# EasyEDA Pro project kuafu02_NI高低温板.eprj, board PCB1
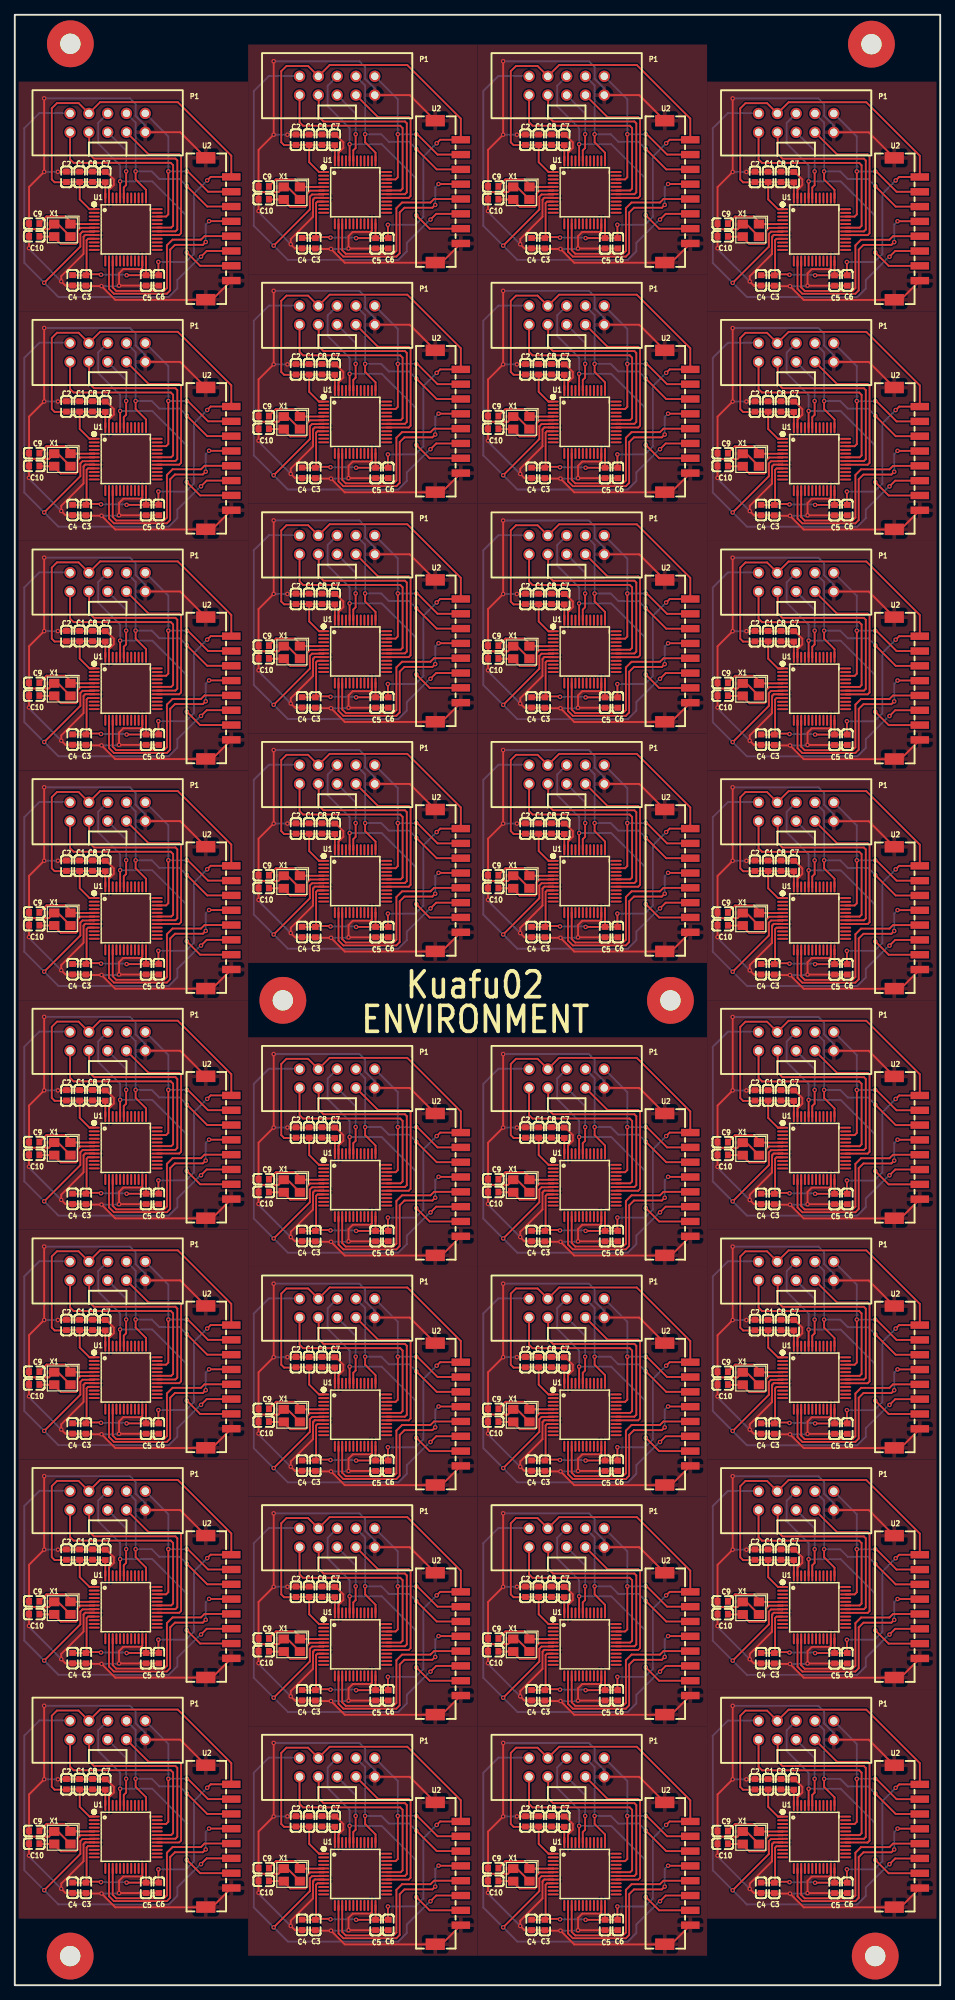
[diagram p1: board, top side]
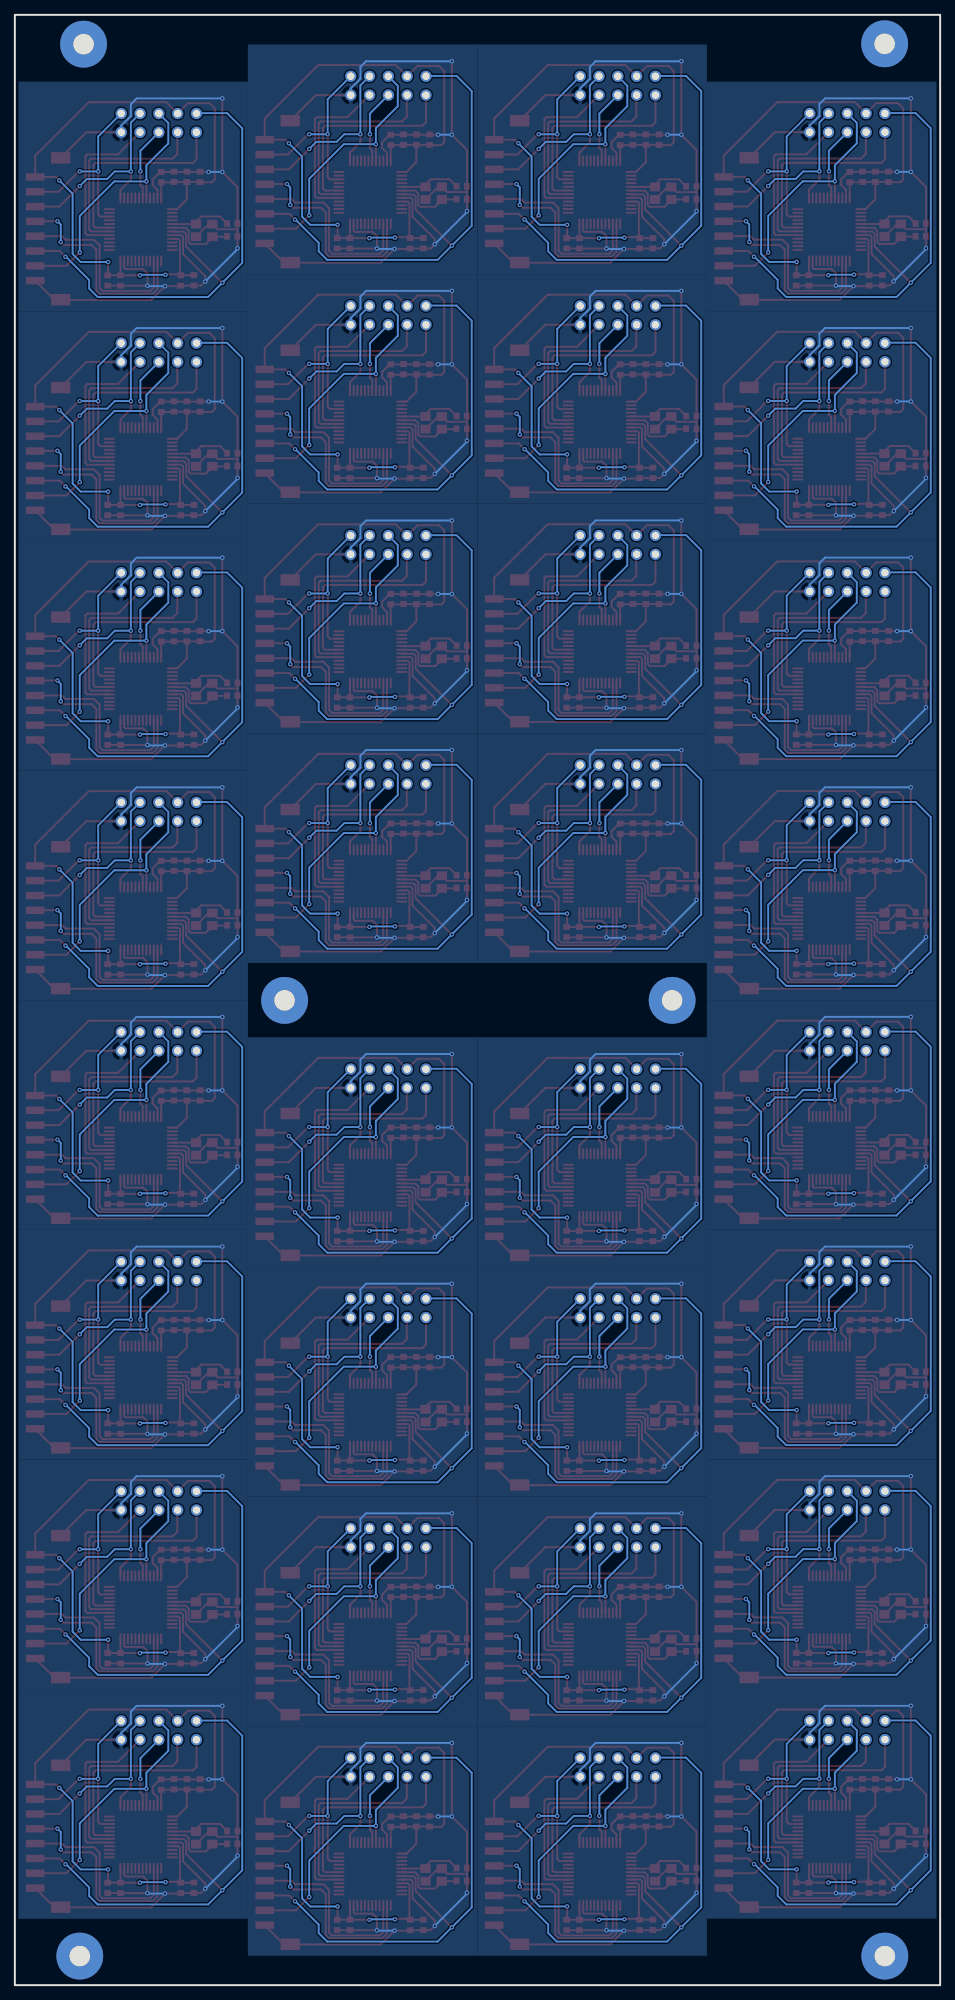
[diagram p2: board, bottom side, seen from below]

Outline 125 x 266 mm; copper layers: Top Layer, Bottom Layer. Coordinates in mm from the lower left corner of the outline.
Outline path: rectangle 0,266 125,0
Stack: Top Layer 0.035mm / Dielectric1 1.51mm FR4 er 4.5 / Bottom Layer 0.035mm

## Design rules (mm)
template: 自定义配置
spacing copperThickness1oz (default): track to track 0.102, other pairs 0.152 to 0.3
spacing copperThickness2oz: track to track 0.203, other pairs 0.152 to 0.3
track width copperThickness1oz (default): min 0.127, default 0.254, max 2.54
track width copperThickness2oz: min 0.203, default 0.254, max 2.54
differential pair differentialPair (default): width min 0.127, default 0.254, max 2.54; gap min 0.152, default 0.152
via viaSize (default): diameter min 0.5, default 0.61, max 10; hole min 0.3, default 0.305, max 6.3

## Placement (name value [footprint] x y rotation side)
C1  100nF  [C0603]  8.75 244.13 90 top
C1#2  -  [C0603]  8.75 213.13 90 top
C1#3  -  [C0603]  8.75 182.13 90 top
C1#4  -  [C0603]  8.75 151.13 90 top
C1#5  -  [C0603]  8.75 120.13 90 top
C1#6  -  [C0603]  8.75 89.13 90 top
C1#7  -  [C0603]  8.75 58.13 90 top
C1#8  -  [C0603]  8.75 27.13 90 top
C1#9  -  [C0603]  39.75 249.14 90 top
C1#10  -  [C0603]  39.75 218.14 90 top
C1#11  -  [C0603]  39.75 187.15 90 top
C1#12  -  [C0603]  39.75 156.15 90 top
C1#13  -  [C0603]  39.75 115.11 90 top
C1#14  -  [C0603]  39.75 84.11 90 top
C1#15  -  [C0603]  39.75 53.11 90 top
C1#16  -  [C0603]  39.75 22.11 90 top
C1#17  -  [C0603]  70.75 249.14 90 top
C1#18  -  [C0603]  70.75 218.14 90 top
C1#19  -  [C0603]  70.75 187.14 90 top
C1#20  -  [C0603]  70.75 156.15 90 top
C1#21  -  [C0603]  70.75 115.11 90 top
C1#22  -  [C0603]  70.75 84.11 90 top
C1#23  -  [C0603]  70.75 53.11 90 top
C1#24  -  [C0603]  70.75 22.11 90 top
C1#25  -  [C0603]  101.75 244.12 90 top
C1#26  -  [C0603]  101.75 213.12 90 top
C1#27  -  [C0603]  101.75 182.12 90 top
C1#28  -  [C0603]  101.75 151.12 90 top
C1#29  -  [C0603]  101.75 120.12 90 top
C1#30  -  [C0603]  101.75 89.12 90 top
C1#31  -  [C0603]  101.75 58.12 90 top
C1#32  -  [C0603]  101.75 27.12 90 top
C2  10uF  [C0603]  6.97 27.13 90 top
C2#2  -  [C0603]  99.98 89.12 90 top
C2#3  -  [C0603]  6.97 213.13 90 top
C2#4  -  [C0603]  6.97 182.13 90 top
C2#5  -  [C0603]  6.97 151.13 90 top
C2#6  -  [C0603]  6.97 120.13 90 top
C2#7  -  [C0603]  6.97 89.13 90 top
C2#8  -  [C0603]  6.97 58.13 90 top
C2#9  -  [C0603]  37.97 249.14 90 top
C2#10  -  [C0603]  37.97 218.14 90 top
C2#11  -  [C0603]  37.97 187.15 90 top
C2#12  -  [C0603]  37.97 156.15 90 top
C2#13  -  [C0603]  37.97 115.11 90 top
C2#14  -  [C0603]  37.97 84.11 90 top
C2#15  -  [C0603]  37.97 53.11 90 top
C2#16  -  [C0603]  37.97 22.11 90 top
C2#17  -  [C0603]  68.98 249.14 90 top
C2#18  -  [C0603]  68.98 218.14 90 top
C2#19  -  [C0603]  68.98 187.14 90 top
C2#20  -  [C0603]  68.98 156.15 90 top
C2#21  -  [C0603]  68.98 115.11 90 top
C2#22  -  [C0603]  68.98 84.11 90 top
C2#23  -  [C0603]  68.98 53.11 90 top
C2#24  -  [C0603]  68.98 22.11 90 top
C2#25  -  [C0603]  99.98 244.12 90 top
C2#26  -  [C0603]  6.97 244.13 90 top
C2#27  -  [C0603]  99.98 213.12 90 top
C2#28  -  [C0603]  99.98 182.12 90 top
C2#29  -  [C0603]  99.98 151.12 90 top
C2#30  -  [C0603]  99.98 120.12 90 top
C2#31  -  [C0603]  99.98 58.12 90 top
C2#32  -  [C0603]  99.98 27.12 90 top
C3  100nF  [C0603]  9.6 199.14 90 top
C3#2  -  [C0603]  9.6 168.14 90 top
C3#3  -  [C0603]  9.6 137.14 90 top
C3#4  -  [C0603]  9.6 106.14 90 top
C3#5  -  [C0603]  9.6 75.14 90 top
C3#6  -  [C0603]  9.6 44.14 90 top
C3#7  -  [C0603]  9.6 13.14 90 top
C3#8  -  [C0603]  40.6 235.16 90 top
C3#9  -  [C0603]  40.6 204.16 90 top
C3#10  -  [C0603]  40.6 173.16 90 top
C3#11  -  [C0603]  40.6 142.16 90 top
C3#12  -  [C0603]  40.6 101.13 90 top
C3#13  -  [C0603]  40.6 70.13 90 top
C3#14  -  [C0603]  40.6 39.13 90 top
C3#15  -  [C0603]  40.6 8.13 90 top
C3#16  -  [C0603]  71.6 235.16 90 top
C3#17  -  [C0603]  71.6 204.16 90 top
C3#18  -  [C0603]  71.6 173.16 90 top
C3#19  -  [C0603]  71.6 142.16 90 top
C3#20  -  [C0603]  71.6 101.13 90 top
C3#21  -  [C0603]  71.6 70.13 90 top
C3#22  -  [C0603]  71.6 39.13 90 top
C3#23  -  [C0603]  71.6 8.13 90 top
C3#24  -  [C0603]  102.6 230.13 90 top
C3#25  -  [C0603]  102.6 199.13 90 top
C3#26  -  [C0603]  102.6 168.13 90 top
C3#27  -  [C0603]  102.6 137.13 90 top
C3#28  -  [C0603]  102.6 106.13 90 top
C3#29  -  [C0603]  102.6 75.13 90 top
C3#30  -  [C0603]  102.6 44.13 90 top
C3#31  -  [C0603]  9.6 230.14 90 top
C3#32  -  [C0603]  102.6 13.13 90 top
C4  10uF  [C0603]  7.8 13.16 90 top
C4#2  -  [C0603]  100.8 75.15 90 top
C4#3  -  [C0603]  7.8 199.16 90 top
C4#4  -  [C0603]  7.8 168.16 90 top
C4#5  -  [C0603]  7.8 137.16 90 top
C4#6  -  [C0603]  7.8 106.16 90 top
C4#7  -  [C0603]  7.8 75.16 90 top
C4#8  -  [C0603]  7.8 44.16 90 top
C4#9  -  [C0603]  38.8 235.17 90 top
C4#10  -  [C0603]  38.8 204.17 90 top
C4#11  -  [C0603]  38.8 173.18 90 top
C4#12  -  [C0603]  38.8 142.18 90 top
C4#13  -  [C0603]  38.8 101.14 90 top
C4#14  -  [C0603]  38.8 70.14 90 top
C4#15  -  [C0603]  38.8 39.14 90 top
C4#16  -  [C0603]  38.8 8.14 90 top
C4#17  -  [C0603]  69.8 235.17 90 top
C4#18  -  [C0603]  69.8 204.17 90 top
C4#19  -  [C0603]  69.8 173.17 90 top
C4#20  -  [C0603]  69.8 142.18 90 top
C4#21  -  [C0603]  69.8 101.14 90 top
C4#22  -  [C0603]  69.8 70.14 90 top
C4#23  -  [C0603]  69.8 39.14 90 top
C4#24  -  [C0603]  69.8 8.14 90 top
C4#25  -  [C0603]  100.8 230.15 90 top
C4#26  -  [C0603]  100.8 199.15 90 top
C4#27  -  [C0603]  100.8 168.15 90 top
C4#28  -  [C0603]  100.8 137.15 90 top
C4#29  -  [C0603]  100.8 106.15 90 top
C4#30  -  [C0603]  100.8 44.15 90 top
C4#31  -  [C0603]  100.8 13.15 90 top
C4#32  -  [C0603]  7.8 230.16 90 top
C5  100nF  [C0603]  17.73 199.14 90 top
C5#2  -  [C0603]  17.73 168.14 90 top
C5#3  -  [C0603]  17.73 137.14 90 top
C5#4  -  [C0603]  17.73 106.14 90 top
C5#5  -  [C0603]  17.73 75.14 90 top
C5#6  -  [C0603]  17.73 44.14 90 top
C5#7  -  [C0603]  17.73 13.14 90 top
C5#8  -  [C0603]  48.73 235.16 90 top
C5#9  -  [C0603]  48.73 204.16 90 top
C5#10  -  [C0603]  48.73 173.16 90 top
C5#11  -  [C0603]  48.73 142.16 90 top
C5#12  -  [C0603]  48.73 101.13 90 top
C5#13  -  [C0603]  48.73 70.13 90 top
C5#14  -  [C0603]  48.73 39.13 90 top
C5#15  -  [C0603]  48.73 8.13 90 top
C5#16  -  [C0603]  79.73 235.16 90 top
C5#17  -  [C0603]  79.73 204.16 90 top
C5#18  -  [C0603]  79.73 173.16 90 top
C5#19  -  [C0603]  79.73 142.16 90 top
C5#20  -  [C0603]  79.73 101.13 90 top
C5#21  -  [C0603]  79.73 70.13 90 top
C5#22  -  [C0603]  79.73 39.13 90 top
C5#23  -  [C0603]  79.73 8.13 90 top
C5#24  -  [C0603]  110.73 230.13 90 top
C5#25  -  [C0603]  110.73 199.13 90 top
C5#26  -  [C0603]  110.73 168.13 90 top
C5#27  -  [C0603]  110.73 137.13 90 top
C5#28  -  [C0603]  110.73 106.13 90 top
C5#29  -  [C0603]  110.73 75.13 90 top
C5#30  -  [C0603]  110.73 44.13 90 top
C5#31  -  [C0603]  110.73 13.13 90 top
C5#32  -  [C0603]  17.73 230.14 90 top
C6  10uF  [C0603]  19.46 199.14 270 top
C6#2  -  [C0603]  19.46 168.14 270 top
C6#3  -  [C0603]  19.46 137.14 270 top
C6#4  -  [C0603]  19.46 106.14 270 top
C6#5  -  [C0603]  19.46 75.14 270 top
C6#6  -  [C0603]  19.46 44.14 270 top
C6#7  -  [C0603]  19.46 13.14 270 top
C6#8  -  [C0603]  50.46 235.16 270 top
C6#9  -  [C0603]  50.46 204.16 270 top
C6#10  -  [C0603]  50.46 173.16 270 top
C6#11  -  [C0603]  50.46 142.16 270 top
C6#12  -  [C0603]  50.46 101.13 270 top
C6#13  -  [C0603]  50.46 70.13 270 top
C6#14  -  [C0603]  50.46 39.13 270 top
C6#15  -  [C0603]  50.46 8.13 270 top
C6#16  -  [C0603]  81.46 235.16 270 top
C6#17  -  [C0603]  81.46 204.16 270 top
C6#18  -  [C0603]  81.46 173.16 270 top
C6#19  -  [C0603]  81.46 142.16 270 top
C6#20  -  [C0603]  81.46 101.13 270 top
C6#21  -  [C0603]  81.46 70.13 270 top
C6#22  -  [C0603]  81.46 39.13 270 top
C6#23  -  [C0603]  81.46 8.13 270 top
C6#24  -  [C0603]  112.46 230.13 270 top
C6#25  -  [C0603]  112.46 199.13 270 top
C6#26  -  [C0603]  112.46 168.13 270 top
C6#27  -  [C0603]  112.46 137.13 270 top
C6#28  -  [C0603]  112.46 106.13 270 top
C6#29  -  [C0603]  112.46 75.13 270 top
C6#30  -  [C0603]  112.46 44.13 270 top
C6#31  -  [C0603]  112.46 13.13 270 top
C6#32  -  [C0603]  19.46 230.14 270 top
C7  100nF  [C0603]  12.22 213.1 270 top
C7#2  -  [C0603]  12.22 182.1 270 top
C7#3  -  [C0603]  12.22 151.1 270 top
C7#4  -  [C0603]  12.22 120.1 270 top
C7#5  -  [C0603]  12.22 89.1 270 top
C7#6  -  [C0603]  12.22 58.1 270 top
C7#7  -  [C0603]  12.22 27.1 270 top
C7#8  -  [C0603]  43.22 249.11 270 top
C7#9  -  [C0603]  43.22 218.11 270 top
C7#10  -  [C0603]  74.22 187.11 270 top
C7#11  -  [C0603]  43.22 187.12 270 top
C7#12  -  [C0603]  43.22 156.12 270 top
C7#13  -  [C0603]  12.22 244.1 270 top
C7#14  -  [C0603]  43.22 115.08 270 top
C7#15  -  [C0603]  43.22 84.08 270 top
C7#16  -  [C0603]  43.22 53.08 270 top
C7#17  -  [C0603]  43.22 22.08 270 top
C7#18  -  [C0603]  74.22 249.11 270 top
C7#19  -  [C0603]  74.22 218.11 270 top
C7#20  -  [C0603]  74.22 156.12 270 top
C7#21  -  [C0603]  74.22 115.08 270 top
C7#22  -  [C0603]  74.22 84.08 270 top
C7#23  -  [C0603]  74.22 53.08 270 top
C7#24  -  [C0603]  74.22 22.08 270 top
C7#25  -  [C0603]  105.22 244.09 270 top
C7#26  -  [C0603]  105.22 213.09 270 top
C7#27  -  [C0603]  105.22 182.09 270 top
C7#28  -  [C0603]  105.22 151.09 270 top
C7#29  -  [C0603]  105.22 120.09 270 top
C7#30  -  [C0603]  105.22 89.09 270 top
C7#31  -  [C0603]  105.22 58.09 270 top
C7#32  -  [C0603]  105.22 27.09 270 top
C8  10uF  [C0603]  10.5 213.14 90 top
C8#2  -  [C0603]  10.5 182.14 90 top
C8#3  -  [C0603]  10.5 151.14 90 top
C8#4  -  [C0603]  10.5 120.14 90 top
C8#5  -  [C0603]  10.5 89.14 90 top
C8#6  -  [C0603]  10.5 58.14 90 top
C8#7  -  [C0603]  10.5 27.14 90 top
C8#8  -  [C0603]  41.5 249.15 90 top
C8#9  -  [C0603]  41.5 218.15 90 top
C8#10  -  [C0603]  41.5 187.16 90 top
C8#11  -  [C0603]  41.5 156.16 90 top
C8#12  -  [C0603]  10.5 244.14 90 top
C8#13  -  [C0603]  41.5 115.12 90 top
C8#14  -  [C0603]  41.5 84.12 90 top
C8#15  -  [C0603]  41.5 53.12 90 top
C8#16  -  [C0603]  41.5 22.12 90 top
C8#17  -  [C0603]  72.5 249.15 90 top
C8#18  -  [C0603]  72.5 218.15 90 top
C8#19  -  [C0603]  72.5 187.15 90 top
C8#20  -  [C0603]  72.5 156.16 90 top
C8#21  -  [C0603]  72.5 115.12 90 top
C8#22  -  [C0603]  72.5 84.12 90 top
C8#23  -  [C0603]  72.5 53.12 90 top
C8#24  -  [C0603]  72.5 22.12 90 top
C8#25  -  [C0603]  103.5 244.13 90 top
C8#26  -  [C0603]  103.5 213.13 90 top
C8#27  -  [C0603]  103.5 182.13 90 top
C8#28  -  [C0603]  103.5 151.13 90 top
C8#29  -  [C0603]  103.5 120.13 90 top
C8#30  -  [C0603]  103.5 89.13 90 top
C8#31  -  [C0603]  103.5 58.13 90 top
C8#32  -  [C0603]  103.5 27.13 90 top
C9  12pF  [C0603]  2.62 206.82 180 top
C9#2  -  [C0603]  2.62 175.82 180 top
C9#3  -  [C0603]  2.62 144.82 180 top
C9#4  -  [C0603]  2.62 113.82 180 top
C9#5  -  [C0603]  2.62 82.82 180 top
C9#6  -  [C0603]  2.62 51.82 180 top
C9#7  -  [C0603]  2.62 20.82 180 top
C9#8  -  [C0603]  33.62 242.84 180 top
C9#9  -  [C0603]  33.62 211.84 180 top
C9#10  -  [C0603]  33.62 180.84 180 top
C9#11  -  [C0603]  33.62 149.84 180 top
C9#12  -  [C0603]  33.62 108.81 180 top
C9#13  -  [C0603]  33.62 77.81 180 top
C9#14  -  [C0603]  33.62 46.81 180 top
C9#15  -  [C0603]  2.62 237.82 180 top
C9#16  -  [C0603]  33.62 15.81 180 top
C9#17  -  [C0603]  64.62 242.84 180 top
C9#18  -  [C0603]  64.62 211.84 180 top
C9#19  -  [C0603]  64.62 180.84 180 top
C9#20  -  [C0603]  64.62 149.84 180 top
C9#21  -  [C0603]  64.62 108.81 180 top
C9#22  -  [C0603]  64.62 77.81 180 top
C9#23  -  [C0603]  64.62 46.81 180 top
C9#24  -  [C0603]  64.62 15.81 180 top
C9#25  -  [C0603]  95.62 237.81 180 top
C9#26  -  [C0603]  95.62 206.81 180 top
C9#27  -  [C0603]  95.62 175.81 180 top
C9#28  -  [C0603]  95.62 144.81 180 top
C9#29  -  [C0603]  95.62 113.81 180 top
C9#30  -  [C0603]  95.62 82.81 180 top
C9#31  -  [C0603]  95.62 51.81 180 top
C9#32  -  [C0603]  95.62 20.81 180 top
C10  12pF  [C0603]  2.62 205.1 0 top
C10#2  -  [C0603]  2.62 174.1 0 top
C10#3  -  [C0603]  2.62 143.1 0 top
C10#4  -  [C0603]  2.62 112.1 0 top
C10#5  -  [C0603]  2.62 81.1 0 top
C10#6  -  [C0603]  2.62 50.1 0 top
C10#7  -  [C0603]  2.62 19.1 0 top
C10#8  -  [C0603]  33.62 241.11 0 top
C10#9  -  [C0603]  33.62 210.11 0 top
C10#10  -  [C0603]  33.62 179.12 0 top
C10#11  -  [C0603]  33.62 148.12 0 top
C10#12  -  [C0603]  33.62 107.08 0 top
C10#13  -  [C0603]  33.62 76.08 0 top
C10#14  -  [C0603]  33.62 45.08 0 top
C10#15  -  [C0603]  33.62 14.08 0 top
C10#16  -  [C0603]  2.62 236.1 0 top
C10#17  -  [C0603]  64.62 241.11 0 top
C10#18  -  [C0603]  64.62 210.11 0 top
C10#19  -  [C0603]  64.62 179.11 0 top
C10#20  -  [C0603]  64.62 148.12 0 top
C10#21  -  [C0603]  64.62 107.08 0 top
C10#22  -  [C0603]  64.62 76.08 0 top
C10#23  -  [C0603]  64.62 45.08 0 top
C10#24  -  [C0603]  64.62 14.08 0 top
C10#25  -  [C0603]  95.62 236.09 0 top
C10#26  -  [C0603]  95.62 205.09 0 top
C10#27  -  [C0603]  95.62 174.09 0 top
C10#28  -  [C0603]  95.62 143.09 0 top
C10#29  -  [C0603]  95.62 112.09 0 top
C10#30  -  [C0603]  95.62 81.09 0 top
C10#31  -  [C0603]  95.62 50.09 0 top
C10#32  -  [C0603]  95.62 19.09 0 top
J1  -  [demo板安装孔]  7.48 3.93 0 top
J1#2  -  [demo板安装孔]  36.21 132.95 0 top
J1#3  -  [demo板安装孔]  115.71 262.03 0 top
J1#4  -  [demo板安装孔]  88.56 132.95 0 top
J1#5  -  [demo板安装孔]  116.22 3.93 0 top
J1#6  -  [demo板安装孔]  7.5 262.09 0 top
P1  2.54-2*5P简牛  [IDC-TH_10P-P2.54_C5665]  12.54 220.42 0 top
P1#2  -  [IDC-TH_10P-P2.54_C5665]  12.54 189.42 0 top
P1#3  -  [IDC-TH_10P-P2.54_C5665]  12.54 158.42 0 top
P1#4  -  [IDC-TH_10P-P2.54_C5665]  12.54 127.42 0 top
P1#5  -  [IDC-TH_10P-P2.54_C5665]  12.54 96.42 0 top
P1#6  -  [IDC-TH_10P-P2.54_C5665]  12.54 65.42 0 top
P1#7  -  [IDC-TH_10P-P2.54_C5665]  12.54 34.42 0 top
P1#8  -  [IDC-TH_10P-P2.54_C5665]  43.54 256.43 0 top
P1#9  -  [IDC-TH_10P-P2.54_C5665]  43.54 225.43 0 top
P1#10  -  [IDC-TH_10P-P2.54_C5665]  43.54 194.44 0 top
P1#11  -  [IDC-TH_10P-P2.54_C5665]  43.54 163.44 0 top
P1#12  -  [IDC-TH_10P-P2.54_C5665]  43.54 122.4 0 top
P1#13  -  [IDC-TH_10P-P2.54_C5665]  43.54 91.4 0 top
P1#14  -  [IDC-TH_10P-P2.54_C5665]  12.54 251.42 0 top
P1#15  -  [IDC-TH_10P-P2.54_C5665]  43.54 60.4 0 top
P1#16  -  [IDC-TH_10P-P2.54_C5665]  43.54 29.4 0 top
P1#17  -  [IDC-TH_10P-P2.54_C5665]  74.54 256.43 0 top
P1#18  -  [IDC-TH_10P-P2.54_C5665]  74.54 225.43 0 top
P1#19  -  [IDC-TH_10P-P2.54_C5665]  74.54 194.43 0 top
P1#20  -  [IDC-TH_10P-P2.54_C5665]  74.54 163.44 0 top
P1#21  -  [IDC-TH_10P-P2.54_C5665]  74.54 122.4 0 top
P1#22  -  [IDC-TH_10P-P2.54_C5665]  74.54 91.4 0 top
P1#23  -  [IDC-TH_10P-P2.54_C5665]  74.54 60.4 0 top
P1#24  -  [IDC-TH_10P-P2.54_C5665]  74.54 29.4 0 top
P1#25  -  [IDC-TH_10P-P2.54_C5665]  105.54 251.41 0 top
P1#26  -  [IDC-TH_10P-P2.54_C5665]  105.54 220.41 0 top
P1#27  -  [IDC-TH_10P-P2.54_C5665]  105.54 189.41 0 top
P1#28  -  [IDC-TH_10P-P2.54_C5665]  105.54 158.41 0 top
P1#29  -  [IDC-TH_10P-P2.54_C5665]  105.54 127.41 0 top
P1#30  -  [IDC-TH_10P-P2.54_C5665]  105.54 96.41 0 top
P1#31  -  [IDC-TH_10P-P2.54_C5665]  105.54 65.41 0 top
P1#32  -  [IDC-TH_10P-P2.54_C5665]  105.54 34.41 0 top
U1  -  [LQFP-48_L7.0-W7.0-P0.50-LS9.0-BL]  14.98 206.02 270 top
U1#2  -  [LQFP-48_L7.0-W7.0-P0.50-LS9.0-BL]  14.98 175.02 270 top
U1#3  -  [LQFP-48_L7.0-W7.0-P0.50-LS9.0-BL]  14.98 144.02 270 top
U1#4  -  [LQFP-48_L7.0-W7.0-P0.50-LS9.0-BL]  14.98 113.02 270 top
U1#5  -  [LQFP-48_L7.0-W7.0-P0.50-LS9.0-BL]  14.98 82.02 270 top
U1#6  -  [LQFP-48_L7.0-W7.0-P0.50-LS9.0-BL]  14.98 51.02 270 top
U1#7  -  [LQFP-48_L7.0-W7.0-P0.50-LS9.0-BL]  14.98 20.02 270 top
U1#8  -  [LQFP-48_L7.0-W7.0-P0.50-LS9.0-BL]  45.98 242.03 270 top
U1#9  -  [LQFP-48_L7.0-W7.0-P0.50-LS9.0-BL]  45.98 211.03 270 top
U1#10  -  [LQFP-48_L7.0-W7.0-P0.50-LS9.0-BL]  45.98 180.04 270 top
U1#11  -  [LQFP-48_L7.0-W7.0-P0.50-LS9.0-BL]  45.98 149.04 270 top
U1#12  -  [LQFP-48_L7.0-W7.0-P0.50-LS9.0-BL]  45.98 108 270 top
U1#13  -  [LQFP-48_L7.0-W7.0-P0.50-LS9.0-BL]  45.98 77 270 top
U1#14  -  [LQFP-48_L7.0-W7.0-P0.50-LS9.0-BL]  45.98 46 270 top
U1#15  -  [LQFP-48_L7.0-W7.0-P0.50-LS9.0-BL]  45.98 15 270 top
U1#16  -  [LQFP-48_L7.0-W7.0-P0.50-LS9.0-BL]  76.98 242.03 270 top
U1#17  -  [LQFP-48_L7.0-W7.0-P0.50-LS9.0-BL]  76.98 211.03 270 top
U1#18  -  [LQFP-48_L7.0-W7.0-P0.50-LS9.0-BL]  76.98 180.03 270 top
U1#19  -  [LQFP-48_L7.0-W7.0-P0.50-LS9.0-BL]  76.98 149.04 270 top
U1#20  -  [LQFP-48_L7.0-W7.0-P0.50-LS9.0-BL]  76.98 108 270 top
U1#21  -  [LQFP-48_L7.0-W7.0-P0.50-LS9.0-BL]  76.98 77 270 top
U1#22  -  [LQFP-48_L7.0-W7.0-P0.50-LS9.0-BL]  76.98 46 270 top
U1#23  -  [LQFP-48_L7.0-W7.0-P0.50-LS9.0-BL]  76.98 15 270 top
U1#24  -  [LQFP-48_L7.0-W7.0-P0.50-LS9.0-BL]  107.98 237.01 270 top
U1#25  -  [LQFP-48_L7.0-W7.0-P0.50-LS9.0-BL]  107.98 206.01 270 top
U1#26  -  [LQFP-48_L7.0-W7.0-P0.50-LS9.0-BL]  107.98 175.01 270 top
U1#27  -  [LQFP-48_L7.0-W7.0-P0.50-LS9.0-BL]  107.98 144.01 270 top
U1#28  -  [LQFP-48_L7.0-W7.0-P0.50-LS9.0-BL]  107.98 113.01 270 top
U1#29  -  [LQFP-48_L7.0-W7.0-P0.50-LS9.0-BL]  107.98 82.01 270 top
U1#30  -  [LQFP-48_L7.0-W7.0-P0.50-LS9.0-BL]  107.98 51.01 270 top
U1#31  -  [LQFP-48_L7.0-W7.0-P0.50-LS9.0-BL]  107.98 20.01 270 top
U1#32  -  [LQFP-48_L7.0-W7.0-P0.50-LS9.0-BL]  14.98 237.02 270 top
U2  A2008WV-S-8P  [CONN-SMD_A2008WV-S-8P]  27.52 206.12 270 top
U2#2  -  [CONN-SMD_A2008WV-S-8P]  27.52 175.12 270 top
U2#3  -  [CONN-SMD_A2008WV-S-8P]  27.52 144.12 270 top
U2#4  -  [CONN-SMD_A2008WV-S-8P]  27.52 113.12 270 top
U2#5  -  [CONN-SMD_A2008WV-S-8P]  27.52 82.12 270 top
U2#6  -  [CONN-SMD_A2008WV-S-8P]  27.52 51.12 270 top
U2#7  -  [CONN-SMD_A2008WV-S-8P]  27.52 20.12 270 top
U2#8  -  [CONN-SMD_A2008WV-S-8P]  58.52 242.13 270 top
U2#9  -  [CONN-SMD_A2008WV-S-8P]  58.52 211.13 270 top
U2#10  -  [CONN-SMD_A2008WV-S-8P]  58.52 180.14 270 top
U2#11  -  [CONN-SMD_A2008WV-S-8P]  58.52 149.14 270 top
U2#12  -  [CONN-SMD_A2008WV-S-8P]  58.52 108.1 270 top
U2#13  -  [CONN-SMD_A2008WV-S-8P]  58.52 77.1 270 top
U2#14  -  [CONN-SMD_A2008WV-S-8P]  27.52 237.12 270 top
U2#15  -  [CONN-SMD_A2008WV-S-8P]  58.52 46.1 270 top
U2#16  -  [CONN-SMD_A2008WV-S-8P]  58.52 15.1 270 top
U2#17  -  [CONN-SMD_A2008WV-S-8P]  89.52 242.13 270 top
U2#18  -  [CONN-SMD_A2008WV-S-8P]  89.52 211.13 270 top
U2#19  -  [CONN-SMD_A2008WV-S-8P]  89.52 180.13 270 top
U2#20  -  [CONN-SMD_A2008WV-S-8P]  89.52 149.14 270 top
U2#21  -  [CONN-SMD_A2008WV-S-8P]  89.52 108.1 270 top
U2#22  -  [CONN-SMD_A2008WV-S-8P]  89.52 77.1 270 top
U2#23  -  [CONN-SMD_A2008WV-S-8P]  89.52 46.1 270 top
U2#24  -  [CONN-SMD_A2008WV-S-8P]  89.52 15.1 270 top
U2#25  -  [CONN-SMD_A2008WV-S-8P]  120.52 237.11 270 top
U2#26  -  [CONN-SMD_A2008WV-S-8P]  120.52 206.11 270 top
U2#27  -  [CONN-SMD_A2008WV-S-8P]  120.52 175.11 270 top
U2#28  -  [CONN-SMD_A2008WV-S-8P]  120.52 144.11 270 top
U2#29  -  [CONN-SMD_A2008WV-S-8P]  120.52 113.11 270 top
U2#30  -  [CONN-SMD_A2008WV-S-8P]  120.52 82.11 270 top
U2#31  -  [CONN-SMD_A2008WV-S-8P]  120.52 51.11 270 top
U2#32  -  [CONN-SMD_A2008WV-S-8P]  120.52 20.11 270 top
X1  25MHz  [CRYSTAL-SMD_4P-L3.2-W2.5-BL]  6.42 205.91 180 top
X1#2  -  [CRYSTAL-SMD_4P-L3.2-W2.5-BL]  6.42 174.91 180 top
X1#3  -  [CRYSTAL-SMD_4P-L3.2-W2.5-BL]  6.42 143.91 180 top
X1#4  -  [CRYSTAL-SMD_4P-L3.2-W2.5-BL]  6.42 112.91 180 top
X1#5  -  [CRYSTAL-SMD_4P-L3.2-W2.5-BL]  6.42 81.91 180 top
X1#6  -  [CRYSTAL-SMD_4P-L3.2-W2.5-BL]  6.42 50.91 180 top
X1#7  -  [CRYSTAL-SMD_4P-L3.2-W2.5-BL]  6.42 19.91 180 top
X1#8  -  [CRYSTAL-SMD_4P-L3.2-W2.5-BL]  37.42 241.92 180 top
X1#9  -  [CRYSTAL-SMD_4P-L3.2-W2.5-BL]  37.42 210.92 180 top
X1#10  -  [CRYSTAL-SMD_4P-L3.2-W2.5-BL]  37.42 179.93 180 top
X1#11  -  [CRYSTAL-SMD_4P-L3.2-W2.5-BL]  37.42 148.93 180 top
X1#12  -  [CRYSTAL-SMD_4P-L3.2-W2.5-BL]  37.42 107.89 180 top
X1#13  -  [CRYSTAL-SMD_4P-L3.2-W2.5-BL]  37.42 76.89 180 top
X1#14  -  [CRYSTAL-SMD_4P-L3.2-W2.5-BL]  6.42 236.91 180 top
X1#15  -  [CRYSTAL-SMD_4P-L3.2-W2.5-BL]  37.42 45.89 180 top
X1#16  -  [CRYSTAL-SMD_4P-L3.2-W2.5-BL]  37.42 14.89 180 top
X1#17  -  [CRYSTAL-SMD_4P-L3.2-W2.5-BL]  68.42 241.92 180 top
X1#18  -  [CRYSTAL-SMD_4P-L3.2-W2.5-BL]  68.42 210.92 180 top
X1#19  -  [CRYSTAL-SMD_4P-L3.2-W2.5-BL]  68.42 179.92 180 top
X1#20  -  [CRYSTAL-SMD_4P-L3.2-W2.5-BL]  68.42 148.93 180 top
X1#21  -  [CRYSTAL-SMD_4P-L3.2-W2.5-BL]  68.42 107.89 180 top
X1#22  -  [CRYSTAL-SMD_4P-L3.2-W2.5-BL]  68.42 76.89 180 top
X1#23  -  [CRYSTAL-SMD_4P-L3.2-W2.5-BL]  68.42 45.89 180 top
X1#24  -  [CRYSTAL-SMD_4P-L3.2-W2.5-BL]  68.42 14.89 180 top
X1#25  -  [CRYSTAL-SMD_4P-L3.2-W2.5-BL]  99.42 236.9 180 top
X1#26  -  [CRYSTAL-SMD_4P-L3.2-W2.5-BL]  99.42 205.9 180 top
X1#27  -  [CRYSTAL-SMD_4P-L3.2-W2.5-BL]  99.42 174.9 180 top
X1#28  -  [CRYSTAL-SMD_4P-L3.2-W2.5-BL]  99.42 143.9 180 top
X1#29  -  [CRYSTAL-SMD_4P-L3.2-W2.5-BL]  99.42 112.9 180 top
X1#30  -  [CRYSTAL-SMD_4P-L3.2-W2.5-BL]  99.42 81.9 180 top
X1#31  -  [CRYSTAL-SMD_4P-L3.2-W2.5-BL]  99.42 50.9 180 top
X1#32  -  [CRYSTAL-SMD_4P-L3.2-W2.5-BL]  99.42 19.9 180 top

## Footprints (pads in the part's own frame, mm; a bottom-side part is the same pattern mirrored in y, then rotated)
C0603
  rect 0.8x0.9 smd: 1(-0.7,0) 2(0.7,0)
CONN-SMD_A2008WV-S-8P
  rect 1x2.5 smd: 1(-7,1.724) 2(-5,1.724) 3(-3,1.724) 4(-1,1.724) 5(1,1.724) 6(2.999,1.724) 7(5,1.724) 8(7,1.724)
  rect 1.55x2.6 smd: 9(-9.575,-1.724) 10(9.575,-1.724)
CRYSTAL-SMD_4P-L3.2-W2.5-BL
  rect 1.4x1.2 smd: 1(-1.1,-0.85) 2(1.1,-0.85) 3(1.1,0.85) 4(-1.1,0.85)
demo板安装孔
  round 6.32 hole 2.75: 1(0,0)
IDC-TH_10P-P2.54_C5665
  round 1.524 hole 1: 1(-5.08,-1.27) 2(-5.08,1.27) 3(-2.54,-1.27) 4(-2.54,1.27) 5(0,-1.27) 6(0,1.27) 7(2.54,-1.27) 8(2.54,1.27) 9(5.08,-1.27) 10(5.08,1.27)
LQFP-48_L7.0-W7.0-P0.50-LS9.0-BL
  oval 0.27x1.5 smd: 1(-2.75,-4.25) 2(-2.25,-4.25) 3(-1.75,-4.25) 4(-1.25,-4.25) 5(-0.75,-4.25) 6(-0.25,-4.25) 7(0.25,-4.25) 8(0.75,-4.25) 9(1.25,-4.25) 10(1.75,-4.25) 11(2.25,-4.25) 12(2.75,-4.25) 25(2.75,4.25) 26(2.25,4.25) 27(1.75,4.25) 28(1.25,4.25) 29(0.75,4.25) 30(0.25,4.25) 31(-0.25,4.25) 32(-0.75,4.25) 33(-1.25,4.25) 34(-1.75,4.25) 35(-2.25,4.25) 36(-2.75,4.25)
  oval 1.5x0.27 smd: 13(4.25,-2.75) 14(4.25,-2.25) 15(4.25,-1.75) 16(4.25,-1.25) 17(4.25,-0.75) 18(4.25,-0.25) 19(4.25,0.25) 20(4.25,0.75) 21(4.25,1.25) 22(4.25,1.75) 23(4.25,2.25) 24(4.25,2.75) 37(-4.25,2.75) 38(-4.25,2.25) 39(-4.25,1.75) 40(-4.25,1.25) 41(-4.25,0.75) 42(-4.25,0.25) 43(-4.25,-0.25) 44(-4.25,-0.75) 45(-4.25,-1.25) 46(-4.25,-1.75) 47(-4.25,-2.25) 48(-4.25,-2.75)

## Nets
GND: C1.2 C1#2.2 C1#3.2 C1#4.2 C1#5.2 C1#6.2 C1#7.2 C1#8.2 C1#9.2 C1#10.2 C1#11.2 C1#12.2 C1#13.2 C1#14.2 C1#15.2 C1#16.2 C1#17.2 C1#18.2 C1#19.2 C1#20.2 C1#21.2 C1#22.2 C1#23.2 C1#24.2 C1#25.2 C1#26.2 C1#27.2 C1#28.2 C1#29.2 C1#30.2 C1#31.2 C1#32.2 C2.2 C2#2.2 C2#3.2 C2#4.2 C2#5.2 C2#6.2 C2#7.2 C2#8.2 C2#9.2 C2#10.2 C2#11.2 C2#12.2 C2#13.2 C2#14.2 C2#15.2 C2#16.2 C2#17.2 C2#18.2 C2#19.2 C2#20.2 C2#21.2 C2#22.2 C2#23.2 C2#24.2 C2#25.2 C2#26.2 C2#27.2 C2#28.2 C2#29.2 C2#30.2 C2#31.2 C2#32.2 C3.1 C3#2.1 C3#3.1 C3#4.1 C3#5.1 C3#6.1 C3#7.1 C3#8.1 C3#9.1 C3#10.1 C3#11.1 C3#12.1 C3#13.1 C3#14.1 C3#15.1 C3#16.1 C3#17.1 C3#18.1 C3#19.1 C3#20.1 C3#21.1 C3#22.1 C3#23.1 C3#24.1 C3#25.1 C3#26.1 C3#27.1 C3#28.1 C3#29.1 C3#30.1 C3#31.1 C3#32.1 C4.1 C4#2.1 C4#3.1 C4#4.1 C4#5.1 C4#6.1 C4#7.1 C4#8.1 C4#9.1 C4#10.1 C4#11.1 C4#12.1 C4#13.1 C4#14.1 C4#15.1 C4#16.1 C4#17.1 C4#18.1 C4#19.1 C4#20.1 C4#21.1 C4#22.1 C4#23.1 C4#24.1 C4#25.1 C4#26.1 C4#27.1 C4#28.1 C4#29.1 C4#30.1 C4#31.1 C4#32.1 C5.1 C5#2.1 C5#3.1 C5#4.1 C5#5.1 C5#6.1 C5#7.1 C5#8.1 C5#9.1 C5#10.1 C5#11.1 C5#12.1 C5#13.1 C5#14.1 C5#15.1 C5#16.1 C5#17.1 C5#18.1 C5#19.1 C5#20.1 C5#21.1 C5#22.1 C5#23.1 C5#24.1 C5#25.1 C5#26.1 C5#27.1 C5#28.1 C5#29.1 C5#30.1 C5#31.1 C5#32.1 C6.2 C6#2.2 C6#3.2 C6#4.2 C6#5.2 C6#6.2 C6#7.2 C6#8.2 C6#9.2 C6#10.2 C6#11.2 C6#12.2 C6#13.2 C6#14.2 C6#15.2 C6#16.2 C6#17.2 C6#18.2 C6#19.2 C6#20.2 C6#21.2 C6#22.2 C6#23.2 C6#24.2 C6#25.2 C6#26.2 C6#27.2 C6#28.2 C6#29.2 C6#30.2 C6#31.2 C6#32.2 C7.1 C7#2.1 C7#3.1 C7#4.1 C7#5.1 C7#6.1 C7#7.1 C7#8.1 C7#9.1 C7#10.1 C7#11.1 C7#12.1 C7#13.1 C7#14.1 C7#15.1 C7#16.1 C7#17.1 C7#18.1 C7#19.1 C7#20.1 C7#21.1 C7#22.1 C7#23.1 C7#24.1 C7#25.1 C7#26.1 C7#27.1 C7#28.1 C7#29.1 C7#30.1 C7#31.1 C7#32.1 C8.2 C8#2.2 C8#3.2 C8#4.2 C8#5.2 C8#6.2 C8#7.2 C8#8.2 C8#9.2 C8#10.2 C8#11.2 C8#12.2 C8#13.2 C8#14.2 C8#15.2 C8#16.2 C8#17.2 C8#18.2 C8#19.2 C8#20.2 C8#21.2 C8#22.2 C8#23.2 C8#24.2 C8#25.2 C8#26.2 C8#27.2 C8#28.2 C8#29.2 C8#30.2 C8#31.2 C8#32.2 C9.2 C9#2.2 C9#3.2 C9#4.2 C9#5.2 C9#6.2 C9#7.2 C9#8.2 C9#9.2 C9#10.2 C9#11.2 C9#12.2 C9#13.2 C9#14.2 C9#15.2 C9#16.2 C9#17.2 C9#18.2 C9#19.2 C9#20.2 C9#21.2 C9#22.2 C9#23.2 C9#24.2 C9#25.2 C9#26.2 C9#27.2 C9#28.2 C9#29.2 C9#30.2 C9#31.2 C9#32.2 C10.1 C10#2.1 C10#3.1 C10#4.1 C10#5.1 C10#6.1 C10#7.1 C10#8.1 C10#9.1 C10#10.1 C10#11.1 C10#12.1 C10#13.1 C10#14.1 C10#15.1 C10#16.1 C10#17.1 C10#18.1 C10#19.1 C10#20.1 C10#21.1 C10#22.1 C10#23.1 C10#24.1 C10#25.1 C10#26.1 C10#27.1 C10#28.1 C10#29.1 C10#30.1 C10#31.1 C10#32.1 P1.9 P1#2.9 P1#3.9 P1#4.9 P1#5.9 P1#6.9 P1#7.9 P1#8.9 P1#9.9 P1#10.9 P1#11.9 P1#12.9 P1#13.9 P1#14.9 P1#15.9 P1#16.9 P1#17.9 P1#18.9 P1#19.9 P1#20.9 P1#21.9 P1#22.9 P1#23.9 P1#24.9 P1#25.9 P1#26.9 P1#27.9 P1#28.9 P1#29.9 P1#30.9 P1#31.9 P1#32.9 U1.8 U1.23 U1.47 U1#2.8 U1#2.23 U1#2.47 U1#3.8 U1#3.23 U1#3.47 U1#4.8 U1#4.23 U1#4.47 U1#5.8 U1#5.23 U1#5.47 U1#6.8 U1#6.23 U1#6.47 U1#7.8 U1#7.23 U1#7.47 U1#8.8 U1#8.23 U1#8.47 U1#9.8 U1#9.23 U1#9.47 U1#10.8 U1#10.23 U1#10.47 U1#11.8 U1#11.23 U1#11.47 U1#12.8 U1#12.23 U1#12.47 U1#13.8 U1#13.23 U1#13.47 U1#14.8 U1#14.23 U1#14.47 U1#15.8 U1#15.23 U1#15.47 U1#16.8 U1#16.23 U1#16.47 U1#17.8 U1#17.23 U1#17.47 U1#18.8 U1#18.23 U1#18.47 U1#19.8 U1#19.23 U1#19.47 U1#20.8 U1#20.23 U1#20.47 U1#21.8 U1#21.23 U1#21.47 U1#22.8 U1#22.23 U1#22.47 U1#23.8 U1#23.23 U1#23.47 U1#24.8 U1#24.23 U1#24.47 U1#25.8 U1#25.23 U1#25.47 U1#26.8 U1#26.23 U1#26.47 U1#27.8 U1#27.23 U1#27.47 U1#28.8 U1#28.23 U1#28.47 U1#29.8 U1#29.23 U1#29.47 U1#30.8 U1#30.23 U1#30.47 U1#31.8 U1#31.23 U1#31.47 U1#32.8 U1#32.23 U1#32.47 U2.8 U2.9 U2.10 U2#2.8 U2#2.9 U2#2.10 U2#3.8 U2#3.9 U2#3.10 U2#4.8 U2#4.9 U2#4.10 U2#5.8 U2#5.9 U2#5.10 U2#6.8 U2#6.9 U2#6.10 U2#7.8 U2#7.9 U2#7.10 U2#8.8 U2#8.9 U2#8.10 U2#9.8 U2#9.9 U2#9.10 U2#10.8 U2#10.9 U2#10.10 U2#11.8 U2#11.9 U2#11.10 U2#12.8 U2#12.9 U2#12.10 U2#13.8 U2#13.9 U2#13.10 U2#14.8 U2#14.9 U2#14.10 U2#15.8 U2#15.9 U2#15.10 U2#16.8 U2#16.9 U2#16.10 U2#17.8 U2#17.9 U2#17.10 U2#18.8 U2#18.9 U2#18.10 U2#19.8 U2#19.9 U2#19.10 U2#20.8 U2#20.9 U2#20.10 U2#21.8 U2#21.9 U2#21.10 U2#22.8 U2#22.9 U2#22.10 U2#23.8 U2#23.9 U2#23.10 U2#24.8 U2#24.9 U2#24.10 U2#25.8 U2#25.9 U2#25.10 U2#26.8 U2#26.9 U2#26.10 U2#27.8 U2#27.9 U2#27.10 U2#28.8 U2#28.9 U2#28.10 U2#29.8 U2#29.9 U2#29.10 U2#30.8 U2#30.9 U2#30.10 U2#31.8 U2#31.9 U2#31.10 U2#32.8 U2#32.9 U2#32.10 X1.2 X1.4 X1#2.2 X1#2.4 X1#3.2 X1#3.4 X1#4.2 X1#4.4 X1#5.2 X1#5.4 X1#6.2 X1#6.4 X1#7.2 X1#7.4 X1#8.2 X1#8.4 X1#9.2 X1#9.4 X1#10.2 X1#10.4 X1#11.2 X1#11.4 X1#12.2 X1#12.4 X1#13.2 X1#13.4 X1#14.2 X1#14.4 X1#15.2 X1#15.4 X1#16.2 X1#16.4 X1#17.2 X1#17.4 X1#18.2 X1#18.4 X1#19.2 X1#19.4 X1#20.2 X1#20.4 X1#21.2 X1#21.4 X1#22.2 X1#22.4 X1#23.2 X1#23.4 X1#24.2 X1#24.4 X1#25.2 X1#25.4 X1#26.2 X1#26.4 X1#27.2 X1#27.4 X1#28.2 X1#28.4 X1#29.2 X1#29.4 X1#30.2 X1#30.4 X1#31.2 X1#31.4 X1#32.2 X1#32.4
VDD: C1.1 C1#2.1 C1#3.1 C1#4.1 C1#5.1 C1#6.1 C1#7.1 C1#8.1 C1#9.1 C1#10.1 C1#11.1 C1#12.1 C1#13.1 C1#14.1 C1#15.1 C1#16.1 C1#17.1 C1#18.1 C1#19.1 C1#20.1 C1#21.1 C1#22.1 C1#23.1 C1#24.1 C1#25.1 C1#26.1 C1#27.1 C1#28.1 C1#29.1 C1#30.1 C1#31.1 C1#32.1 C2.1 C2#2.1 C2#3.1 C2#4.1 C2#5.1 C2#6.1 C2#7.1 C2#8.1 C2#9.1 C2#10.1 C2#11.1 C2#12.1 C2#13.1 C2#14.1 C2#15.1 C2#16.1 C2#17.1 C2#18.1 C2#19.1 C2#20.1 C2#21.1 C2#22.1 C2#23.1 C2#24.1 C2#25.1 C2#26.1 C2#27.1 C2#28.1 C2#29.1 C2#30.1 C2#31.1 C2#32.1 C3.2 C3#2.2 C3#3.2 C3#4.2 C3#5.2 C3#6.2 C3#7.2 C3#8.2 C3#9.2 C3#10.2 C3#11.2 C3#12.2 C3#13.2 C3#14.2 C3#15.2 C3#16.2 C3#17.2 C3#18.2 C3#19.2 C3#20.2 C3#21.2 C3#22.2 C3#23.2 C3#24.2 C3#25.2 C3#26.2 C3#27.2 C3#28.2 C3#29.2 C3#30.2 C3#31.2 C3#32.2 C4.2 C4#2.2 C4#3.2 C4#4.2 C4#5.2 C4#6.2 C4#7.2 C4#8.2 C4#9.2 C4#10.2 C4#11.2 C4#12.2 C4#13.2 C4#14.2 C4#15.2 C4#16.2 C4#17.2 C4#18.2 C4#19.2 C4#20.2 C4#21.2 C4#22.2 C4#23.2 C4#24.2 C4#25.2 C4#26.2 C4#27.2 C4#28.2 C4#29.2 C4#30.2 C4#31.2 C4#32.2 C5.2 C5#2.2 C5#3.2 C5#4.2 C5#5.2 C5#6.2 C5#7.2 C5#8.2 C5#9.2 C5#10.2 C5#11.2 C5#12.2 C5#13.2 C5#14.2 C5#15.2 C5#16.2 C5#17.2 C5#18.2 C5#19.2 C5#20.2 C5#21.2 C5#22.2 C5#23.2 C5#24.2 C5#25.2 C5#26.2 C5#27.2 C5#28.2 C5#29.2 C5#30.2 C5#31.2 C5#32.2 C6.1 C6#2.1 C6#3.1 C6#4.1 C6#5.1 C6#6.1 C6#7.1 C6#8.1 C6#9.1 C6#10.1 C6#11.1 C6#12.1 C6#13.1 C6#14.1 C6#15.1 C6#16.1 C6#17.1 C6#18.1 C6#19.1 C6#20.1 C6#21.1 C6#22.1 C6#23.1 C6#24.1 C6#25.1 C6#26.1 C6#27.1 C6#28.1 C6#29.1 C6#30.1 C6#31.1 C6#32.1 C7.2 C7#2.2 C7#3.2 C7#4.2 C7#5.2 C7#6.2 C7#7.2 C7#8.2 C7#9.2 C7#10.2 C7#11.2 C7#12.2 C7#13.2 C7#14.2 C7#15.2 C7#16.2 C7#17.2 C7#18.2 C7#19.2 C7#20.2 C7#21.2 C7#22.2 C7#23.2 C7#24.2 C7#25.2 C7#26.2 C7#27.2 C7#28.2 C7#29.2 C7#30.2 C7#31.2 C7#32.2 C8.1 C8#2.1 C8#3.1 C8#4.1 C8#5.1 C8#6.1 C8#7.1 C8#8.1 C8#9.1 C8#10.1 C8#11.1 C8#12.1 C8#13.1 C8#14.1 C8#15.1 C8#16.1 C8#17.1 C8#18.1 C8#19.1 C8#20.1 C8#21.1 C8#22.1 C8#23.1 C8#24.1 C8#25.1 C8#26.1 C8#27.1 C8#28.1 C8#29.1 C8#30.1 C8#31.1 C8#32.1 P1.4 P1#2.4 P1#3.4 P1#4.4 P1#5.4 P1#6.4 P1#7.4 P1#8.4 P1#9.4 P1#10.4 P1#11.4 P1#12.4 P1#13.4 P1#14.4 P1#15.4 P1#16.4 P1#17.4 P1#18.4 P1#19.4 P1#20.4 P1#21.4 P1#22.4 P1#23.4 P1#24.4 P1#25.4 P1#26.4 P1#27.4 P1#28.4 P1#29.4 P1#30.4 P1#31.4 P1#32.4 U1.1 U1.9 U1.24 U1.48 U1#2.1 U1#2.9 U1#2.24 U1#2.48 U1#3.1 U1#3.9 U1#3.24 U1#3.48 U1#4.1 U1#4.9 U1#4.24 U1#4.48 U1#5.1 U1#5.9 U1#5.24 U1#5.48 U1#6.1 U1#6.9 U1#6.24 U1#6.48 U1#7.1 U1#7.9 U1#7.24 U1#7.48 U1#8.1 U1#8.9 U1#8.24 U1#8.48 U1#9.1 U1#9.9 U1#9.24 U1#9.48 U1#10.1 U1#10.9 U1#10.24 U1#10.48 U1#11.1 U1#11.9 U1#11.24 U1#11.48 U1#12.1 U1#12.9 U1#12.24 U1#12.48 U1#13.1 U1#13.9 U1#13.24 U1#13.48 U1#14.1 U1#14.9 U1#14.24 U1#14.48 U1#15.1 U1#15.9 U1#15.24 U1#15.48 U1#16.1 U1#16.9 U1#16.24 U1#16.48 U1#17.1 U1#17.9 U1#17.24 U1#17.48 U1#18.1 U1#18.9 U1#18.24 U1#18.48 U1#19.1 U1#19.9 U1#19.24 U1#19.48 U1#20.1 U1#20.9 U1#20.24 U1#20.48 U1#21.1 U1#21.9 U1#21.24 U1#21.48 U1#22.1 U1#22.9 U1#22.24 U1#22.48 U1#23.1 U1#23.9 U1#23.24 U1#23.48 U1#24.1 U1#24.9 U1#24.24 U1#24.48 U1#25.1 U1#25.9 U1#25.24 U1#25.48 U1#26.1 U1#26.9 U1#26.24 U1#26.48 U1#27.1 U1#27.9 U1#27.24 U1#27.48 U1#28.1 U1#28.9 U1#28.24 U1#28.48 U1#29.1 U1#29.9 U1#29.24 U1#29.48 U1#30.1 U1#30.9 U1#30.24 U1#30.48 U1#31.1 U1#31.9 U1#31.24 U1#31.48 U1#32.1 U1#32.9 U1#32.24 U1#32.48 U2.1 U2#2.1 U2#3.1 U2#4.1 U2#5.1 U2#6.1 U2#7.1 U2#8.1 U2#9.1 U2#10.1 U2#11.1 U2#12.1 U2#13.1 U2#14.1 U2#15.1 U2#16.1 U2#17.1 U2#18.1 U2#19.1 U2#20.1 U2#21.1 U2#22.1 U2#23.1 U2#24.1 U2#25.1 U2#26.1 U2#27.1 U2#28.1 U2#29.1 U2#30.1 U2#31.1 U2#32.1
MCO: P1.6 P1#2.6 P1#3.6 P1#4.6 P1#5.6 P1#6.6 P1#7.6 P1#8.6 P1#9.6 P1#10.6 P1#11.6 P1#12.6 P1#13.6 P1#14.6 P1#15.6 P1#16.6 P1#17.6 P1#18.6 P1#19.6 P1#20.6 P1#21.6 P1#22.6 P1#23.6 P1#24.6 P1#25.6 P1#26.6 P1#27.6 P1#28.6 P1#29.6 P1#30.6 P1#31.6 P1#32.6 U1.44 U1#2.44 U1#3.44 U1#4.44 U1#5.44 U1#6.44 U1#7.44 U1#8.44 U1#9.44 U1#10.44 U1#11.44 U1#12.44 U1#13.44 U1#14.44 U1#15.44 U1#16.44 U1#17.44 U1#18.44 U1#19.44 U1#20.44 U1#21.44 U1#22.44 U1#23.44 U1#24.44 U1#25.44 U1#26.44 U1#27.44 U1#28.44 U1#29.44 U1#30.44 U1#31.44 U1#32.44 U2.7 U2#2.7 U2#3.7 U2#4.7 U2#5.7 U2#6.7 U2#7.7 U2#8.7 U2#9.7 U2#10.7 U2#11.7 U2#12.7 U2#13.7 U2#14.7 U2#15.7 U2#16.7 U2#17.7 U2#18.7 U2#19.7 U2#20.7 U2#21.7 U2#22.7 U2#23.7 U2#24.7 U2#25.7 U2#26.7 U2#27.7 U2#28.7 U2#29.7 U2#30.7 U2#31.7 U2#32.7
OSC_IN: C9.1 C9#2.1 C9#3.1 C9#4.1 C9#5.1 C9#6.1 C9#7.1 C9#8.1 C9#9.1 C9#10.1 C9#11.1 C9#12.1 C9#13.1 C9#14.1 C9#15.1 C9#16.1 C9#17.1 C9#18.1 C9#19.1 C9#20.1 C9#21.1 C9#22.1 C9#23.1 C9#24.1 C9#25.1 C9#26.1 C9#27.1 C9#28.1 C9#29.1 C9#30.1 C9#31.1 C9#32.1 U1.5 U1#2.5 U1#3.5 U1#4.5 U1#5.5 U1#6.5 U1#7.5 U1#8.5 U1#9.5 U1#10.5 U1#11.5 U1#12.5 U1#13.5 U1#14.5 U1#15.5 U1#16.5 U1#17.5 U1#18.5 U1#19.5 U1#20.5 U1#21.5 U1#22.5 U1#23.5 U1#24.5 U1#25.5 U1#26.5 U1#27.5 U1#28.5 U1#29.5 U1#30.5 U1#31.5 U1#32.5 X1.1 X1#2.1 X1#3.1 X1#4.1 X1#5.1 X1#6.1 X1#7.1 X1#8.1 X1#9.1 X1#10.1 X1#11.1 X1#12.1 X1#13.1 X1#14.1 X1#15.1 X1#16.1 X1#17.1 X1#18.1 X1#19.1 X1#20.1 X1#21.1 X1#22.1 X1#23.1 X1#24.1 X1#25.1 X1#26.1 X1#27.1 X1#28.1 X1#29.1 X1#30.1 X1#31.1 X1#32.1
OSC_OUT: C10.2 C10#2.2 C10#3.2 C10#4.2 C10#5.2 C10#6.2 C10#7.2 C10#8.2 C10#9.2 C10#10.2 C10#11.2 C10#12.2 C10#13.2 C10#14.2 C10#15.2 C10#16.2 C10#17.2 C10#18.2 C10#19.2 C10#20.2 C10#21.2 C10#22.2 C10#23.2 C10#24.2 C10#25.2 C10#26.2 C10#27.2 C10#28.2 C10#29.2 C10#30.2 C10#31.2 C10#32.2 U1.6 U1#2.6 U1#3.6 U1#4.6 U1#5.6 U1#6.6 U1#7.6 U1#8.6 U1#9.6 U1#10.6 U1#11.6 U1#12.6 U1#13.6 U1#14.6 U1#15.6 U1#16.6 U1#17.6 U1#18.6 U1#19.6 U1#20.6 U1#21.6 U1#22.6 U1#23.6 U1#24.6 U1#25.6 U1#26.6 U1#27.6 U1#28.6 U1#29.6 U1#30.6 U1#31.6 U1#32.6 X1.3 X1#2.3 X1#3.3 X1#4.3 X1#5.3 X1#6.3 X1#7.3 X1#8.3 X1#9.3 X1#10.3 X1#11.3 X1#12.3 X1#13.3 X1#14.3 X1#15.3 X1#16.3 X1#17.3 X1#18.3 X1#19.3 X1#20.3 X1#21.3 X1#22.3 X1#23.3 X1#24.3 X1#25.3 X1#26.3 X1#27.3 X1#28.3 X1#29.3 X1#30.3 X1#31.3 X1#32.3
RSTN: P1.2 P1#2.2 P1#3.2 P1#4.2 P1#5.2 P1#6.2 P1#7.2 P1#8.2 P1#9.2 P1#10.2 P1#11.2 P1#12.2 P1#13.2 P1#14.2 P1#15.2 P1#16.2 P1#17.2 P1#18.2 P1#19.2 P1#20.2 P1#21.2 P1#22.2 P1#23.2 P1#24.2 P1#25.2 P1#26.2 P1#27.2 P1#28.2 P1#29.2 P1#30.2 P1#31.2 P1#32.2 U1.7 U1#2.7 U1#3.7 U1#4.7 U1#5.7 U1#6.7 U1#7.7 U1#8.7 U1#9.7 U1#10.7 U1#11.7 U1#12.7 U1#13.7 U1#14.7 U1#15.7 U1#16.7 U1#17.7 U1#18.7 U1#19.7 U1#20.7 U1#21.7 U1#22.7 U1#23.7 U1#24.7 U1#25.7 U1#26.7 U1#27.7 U1#28.7 U1#29.7 U1#30.7 U1#31.7 U1#32.7 U2.6 U2#2.6 U2#3.6 U2#4.6 U2#5.6 U2#6.6 U2#7.6 U2#8.6 U2#9.6 U2#10.6 U2#11.6 U2#12.6 U2#13.6 U2#14.6 U2#15.6 U2#16.6 U2#17.6 U2#18.6 U2#19.6 U2#20.6 U2#21.6 U2#22.6 U2#23.6 U2#24.6 U2#25.6 U2#26.6 U2#27.6 U2#28.6 U2#29.6 U2#30.6 U2#31.6 U2#32.6
SWCLK/TAO: P1.8 P1#2.8 P1#3.8 P1#4.8 P1#5.8 P1#6.8 P1#7.8 P1#8.8 P1#9.8 P1#10.8 P1#11.8 P1#12.8 P1#13.8 P1#14.8 P1#15.8 P1#16.8 P1#17.8 P1#18.8 P1#19.8 P1#20.8 P1#21.8 P1#22.8 P1#23.8 P1#24.8 P1#25.8 P1#26.8 P1#27.8 P1#28.8 P1#29.8 P1#30.8 P1#31.8 P1#32.8 U1.37 U1#2.37 U1#3.37 U1#4.37 U1#5.37 U1#6.37 U1#7.37 U1#8.37 U1#9.37 U1#10.37 U1#11.37 U1#12.37 U1#13.37 U1#14.37 U1#15.37 U1#16.37 U1#17.37 U1#18.37 U1#19.37 U1#20.37 U1#21.37 U1#22.37 U1#23.37 U1#24.37 U1#25.37 U1#26.37 U1#27.37 U1#28.37 U1#29.37 U1#30.37 U1#31.37 U1#32.37 U2.3 U2#2.3 U2#3.3 U2#4.3 U2#5.3 U2#6.3 U2#7.3 U2#8.3 U2#9.3 U2#10.3 U2#11.3 U2#12.3 U2#13.3 U2#14.3 U2#15.3 U2#16.3 U2#17.3 U2#18.3 U2#19.3 U2#20.3 U2#21.3 U2#22.3 U2#23.3 U2#24.3 U2#25.3 U2#26.3 U2#27.3 U2#28.3 U2#29.3 U2#30.3 U2#31.3 U2#32.3
SWDIO/TAI: P1.10 P1#2.10 P1#3.10 P1#4.10 P1#5.10 P1#6.10 P1#7.10 P1#8.10 P1#9.10 P1#10.10 P1#11.10 P1#12.10 P1#13.10 P1#14.10 P1#15.10 P1#16.10 P1#17.10 P1#18.10 P1#19.10 P1#20.10 P1#21.10 P1#22.10 P1#23.10 P1#24.10 P1#25.10 P1#26.10 P1#27.10 P1#28.10 P1#29.10 P1#30.10 P1#31.10 P1#32.10 U1.34 U1#2.34 U1#3.34 U1#4.34 U1#5.34 U1#6.34 U1#7.34 U1#8.34 U1#9.34 U1#10.34 U1#11.34 U1#12.34 U1#13.34 U1#14.34 U1#15.34 U1#16.34 U1#17.34 U1#18.34 U1#19.34 U1#20.34 U1#21.34 U1#22.34 U1#23.34 U1#24.34 U1#25.34 U1#26.34 U1#27.34 U1#28.34 U1#29.34 U1#30.34 U1#31.34 U1#32.34 U2.2 U2#2.2 U2#3.2 U2#4.2 U2#5.2 U2#6.2 U2#7.2 U2#8.2 U2#9.2 U2#10.2 U2#11.2 U2#12.2 U2#13.2 U2#14.2 U2#15.2 U2#16.2 U2#17.2 U2#18.2 U2#19.2 U2#20.2 U2#21.2 U2#22.2 U2#23.2 U2#24.2 U2#25.2 U2#26.2 U2#27.2 U2#28.2 U2#29.2 U2#30.2 U2#31.2 U2#32.2
TCLK: P1.5 P1#2.5 P1#3.5 P1#4.5 P1#5.5 P1#6.5 P1#7.5 P1#8.5 P1#9.5 P1#10.5 P1#11.5 P1#12.5 P1#13.5 P1#14.5 P1#15.5 P1#16.5 P1#17.5 P1#18.5 P1#19.5 P1#20.5 P1#21.5 P1#22.5 P1#23.5 P1#24.5 P1#25.5 P1#26.5 P1#27.5 P1#28.5 P1#29.5 P1#30.5 P1#31.5 P1#32.5 U1.43 U1#2.43 U1#3.43 U1#4.43 U1#5.43 U1#6.43 U1#7.43 U1#8.43 U1#9.43 U1#10.43 U1#11.43 U1#12.43 U1#13.43 U1#14.43 U1#15.43 U1#16.43 U1#17.43 U1#18.43 U1#19.43 U1#20.43 U1#21.43 U1#22.43 U1#23.43 U1#24.43 U1#25.43 U1#26.43 U1#27.43 U1#28.43 U1#29.43 U1#30.43 U1#31.43 U1#32.43
TDI: P1.3 P1#2.3 P1#3.3 P1#4.3 P1#5.3 P1#6.3 P1#7.3 P1#8.3 P1#9.3 P1#10.3 P1#11.3 P1#12.3 P1#13.3 P1#14.3 P1#15.3 P1#16.3 P1#17.3 P1#18.3 P1#19.3 P1#20.3 P1#21.3 P1#22.3 P1#23.3 P1#24.3 P1#25.3 P1#26.3 P1#27.3 P1#28.3 P1#29.3 P1#30.3 P1#31.3 P1#32.3 U1.30 U1#2.30 U1#3.30 U1#4.30 U1#5.30 U1#6.30 U1#7.30 U1#8.30 U1#9.30 U1#10.30 U1#11.30 U1#12.30 U1#13.30 U1#14.30 U1#15.30 U1#16.30 U1#17.30 U1#18.30 U1#19.30 U1#20.30 U1#21.30 U1#22.30 U1#23.30 U1#24.30 U1#25.30 U1#26.30 U1#27.30 U1#28.30 U1#29.30 U1#30.30 U1#31.30 U1#32.30
TDO: P1.1 P1#2.1 P1#3.1 P1#4.1 P1#5.1 P1#6.1 P1#7.1 P1#8.1 P1#9.1 P1#10.1 P1#11.1 P1#12.1 P1#13.1 P1#14.1 P1#15.1 P1#16.1 P1#17.1 P1#18.1 P1#19.1 P1#20.1 P1#21.1 P1#22.1 P1#23.1 P1#24.1 P1#25.1 P1#26.1 P1#27.1 P1#28.1 P1#29.1 P1#30.1 P1#31.1 P1#32.1 U1.31 U1#2.31 U1#3.31 U1#4.31 U1#5.31 U1#6.31 U1#7.31 U1#8.31 U1#9.31 U1#10.31 U1#11.31 U1#12.31 U1#13.31 U1#14.31 U1#15.31 U1#16.31 U1#17.31 U1#18.31 U1#19.31 U1#20.31 U1#21.31 U1#22.31 U1#23.31 U1#24.31 U1#25.31 U1#26.31 U1#27.31 U1#28.31 U1#29.31 U1#30.31 U1#31.31 U1#32.31
TSTROBE: P1.7 P1#2.7 P1#3.7 P1#4.7 P1#5.7 P1#6.7 P1#7.7 P1#8.7 P1#9.7 P1#10.7 P1#11.7 P1#12.7 P1#13.7 P1#14.7 P1#15.7 P1#16.7 P1#17.7 P1#18.7 P1#19.7 P1#20.7 P1#21.7 P1#22.7 P1#23.7 P1#24.7 P1#25.7 P1#26.7 P1#27.7 P1#28.7 P1#29.7 P1#30.7 P1#31.7 P1#32.7 U1.29 U1#2.29 U1#3.29 U1#4.29 U1#5.29 U1#6.29 U1#7.29 U1#8.29 U1#9.29 U1#10.29 U1#11.29 U1#12.29 U1#13.29 U1#14.29 U1#15.29 U1#16.29 U1#17.29 U1#18.29 U1#19.29 U1#20.29 U1#21.29 U1#22.29 U1#23.29 U1#24.29 U1#25.29 U1#26.29 U1#27.29 U1#28.29 U1#29.29 U1#30.29 U1#31.29 U1#32.29
UART_RX: U1.15 U1#2.15 U1#3.15 U1#4.15 U1#5.15 U1#6.15 U1#7.15 U1#8.15 U1#9.15 U1#10.15 U1#11.15 U1#12.15 U1#13.15 U1#14.15 U1#15.15 U1#16.15 U1#17.15 U1#18.15 U1#19.15 U1#20.15 U1#21.15 U1#22.15 U1#23.15 U1#24.15 U1#25.15 U1#26.15 U1#27.15 U1#28.15 U1#29.15 U1#30.15 U1#31.15 U1#32.15 U2.5 U2#2.5 U2#3.5 U2#4.5 U2#5.5 U2#6.5 U2#7.5 U2#8.5 U2#9.5 U2#10.5 U2#11.5 U2#12.5 U2#13.5 U2#14.5 U2#15.5 U2#16.5 U2#17.5 U2#18.5 U2#19.5 U2#20.5 U2#21.5 U2#22.5 U2#23.5 U2#24.5 U2#25.5 U2#26.5 U2#27.5 U2#28.5 U2#29.5 U2#30.5 U2#31.5 U2#32.5
UART_TX: U1.14 U1#2.14 U1#3.14 U1#4.14 U1#5.14 U1#6.14 U1#7.14 U1#8.14 U1#9.14 U1#10.14 U1#11.14 U1#12.14 U1#13.14 U1#14.14 U1#15.14 U1#16.14 U1#17.14 U1#18.14 U1#19.14 U1#20.14 U1#21.14 U1#22.14 U1#23.14 U1#24.14 U1#25.14 U1#26.14 U1#27.14 U1#28.14 U1#29.14 U1#30.14 U1#31.14 U1#32.14 U2.4 U2#2.4 U2#3.4 U2#4.4 U2#5.4 U2#6.4 U2#7.4 U2#8.4 U2#9.4 U2#10.4 U2#11.4 U2#12.4 U2#13.4 U2#14.4 U2#15.4 U2#16.4 U2#17.4 U2#18.4 U2#19.4 U2#20.4 U2#21.4 U2#22.4 U2#23.4 U2#24.4 U2#25.4 U2#26.4 U2#27.4 U2#28.4 U2#29.4 U2#30.4 U2#31.4 U2#32.4

Pads without a net: J1 1; J1#2 1; J1#3 1; J1#4 1; J1#5 1; J1#6 1; U1 2 3 4 10 11 12 13 16 17 18 19 20 21 22 25 26 27 28 32 33 35 36 38 39 40 41 42 45 46; U1#2 2 3 4 10 11 12 13 16 17 18 19 20 21 22 25 26 27 28 32 33 35 36 38 39 40 41 42 45 46; U1#3 2 3 4 10 11 12 13 16 17 18 19 20 21 22 25 26 27 28 32 33 35 36 38 39 40 41 42 45 46; U1#4 2 3 4 10 11 12 13 16 17 18 19 20 21 22 25 26 27 28 32 33 35 36 38 39 40 41 42 45 46; U1#5 2 3 4 10 11 12 13 16 17 18 19 20 21 22 25 26 27 28 32 33 35 36 38 39 40 41 42 45 46; U1#6 2 3 4 10 11 12 13 16 17 18 19 20 21 22 25 26 27 28 32 33 35 36 38 39 40 41 42 45 46; U1#7 2 3 4 10 11 12 13 16 17 18 19 20 21 22 25 26 27 28 32 33 35 36 38 39 40 41 42 45 46; U1#8 2 3 4 10 11 12 13 16 17 18 19 20 21 22 25 26 27 28 32 33 35 36 38 39 40 41 42 45 46; U1#9 2 3 4 10 11 12 13 16 17 18 19 20 21 22 25 26 27 28 32 33 35 36 38 39 40 41 42 45 46; U1#10 2 3 4 10 11 12 13 16 17 18 19 20 21 22 25 26 27 28 32 33 35 36 38 39 40 41 42 45 46; U1#11 2 3 4 10 11 12 13 16 17 18 19 20 21 22 25 26 27 28 32 33 35 36 38 39 40 41 42 45 46; U1#12 2 3 4 10 11 12 13 16 17 18 19 20 21 22 25 26 27 28 32 33 35 36 38 39 40 41 42 45 46; U1#13 2 3 4 10 11 12 13 16 17 18 19 20 21 22 25 26 27 28 32 33 35 36 38 39 40 41 42 45 46; U1#14 2 3 4 10 11 12 13 16 17 18 19 20 21 22 25 26 27 28 32 33 35 36 38 39 40 41 42 45 46; U1#15 2 3 4 10 11 12 13 16 17 18 19 20 21 22 25 26 27 28 32 33 35 36 38 39 40 41 42 45 46; U1#16 2 3 4 10 11 12 13 16 17 18 19 20 21 22 25 26 27 28 32 33 35 36 38 39 40 41 42 45 46; U1#17 2 3 4 10 11 12 13 16 17 18 19 20 21 22 25 26 27 28 32 33 35 36 38 39 40 41 42 45 46; U1#18 2 3 4 10 11 12 13 16 17 18 19 20 21 22 25 26 27 28 32 33 35 36 38 39 40 41 42 45 46; U1#19 2 3 4 10 11 12 13 16 17 18 19 20 21 22 25 26 27 28 32 33 35 36 38 39 40 41 42 45 46; U1#20 2 3 4 10 11 12 13 16 17 18 19 20 21 22 25 26 27 28 32 33 35 36 38 39 40 41 42 45 46; U1#21 2 3 4 10 11 12 13 16 17 18 19 20 21 22 25 26 27 28 32 33 35 36 38 39 40 41 42 45 46; U1#22 2 3 4 10 11 12 13 16 17 18 19 20 21 22 25 26 27 28 32 33 35 36 38 39 40 41 42 45 46; U1#23 2 3 4 10 11 12 13 16 17 18 19 20 21 22 25 26 27 28 32 33 35 36 38 39 40 41 42 45 46; U1#24 2 3 4 10 11 12 13 16 17 18 19 20 21 22 25 26 27 28 32 33 35 36 38 39 40 41 42 45 46; U1#25 2 3 4 10 11 12 13 16 17 18 19 20 21 22 25 26 27 28 32 33 35 36 38 39 40 41 42 45 46; U1#26 2 3 4 10 11 12 13 16 17 18 19 20 21 22 25 26 27 28 32 33 35 36 38 39 40 41 42 45 46; U1#27 2 3 4 10 11 12 13 16 17 18 19 20 21 22 25 26 27 28 32 33 35 36 38 39 40 41 42 45 46; U1#28 2 3 4 10 11 12 13 16 17 18 19 20 21 22 25 26 27 28 32 33 35 36 38 39 40 41 42 45 46; U1#29 2 3 4 10 11 12 13 16 17 18 19 20 21 22 25 26 27 28 32 33 35 36 38 39 40 41 42 45 46; U1#30 2 3 4 10 11 12 13 16 17 18 19 20 21 22 25 26 27 28 32 33 35 36 38 39 40 41 42 45 46; U1#31 2 3 4 10 11 12 13 16 17 18 19 20 21 22 25 26 27 28 32 33 35 36 38 39 40 41 42 45 46; U1#32 2 3 4 10 11 12 13 16 17 18 19 20 21 22 25 26 27 28 32 33 35 36 38 39 40 41 42 45 46

## Via types
v1: diameter 0.61, hole 0.305, Top Layer to Bottom Layer, 704 vias

## Routing (per net, layer and track width the routed paths; a pad name or vN(x,y) marks a point on that pad's centre or on a via; arc(x,y) is an arc through that point)
GND: length 3871.1
  Top Layer w0.254: U1#12.47 43.73,113.35 44.38,114 44.38,114.76 43.29,115.85 C7#14.1 38.01,115.78 C2#13.2 37.95,115.78 v1(36.82,115.78) ; U1#13.8 41.71,76.27 40.53,76.27 40.28,76.02 40.28,73.71 37.27,70.7 v1(37.27,70) 37.83,69.44 38.8,69.44 38.82,69.43 C3#13.1 40.67,69.36 v1(42.71,69.36) 44.57,67.5 56.77,67.5 U2#13.10 57.67,67.53 U2#13.8 ; U1#25.8 103.71,205.28 102.53,205.28 102.28,205.02 102.28,202.72 99.27,199.71 v1(99.27,199.01) 99.83,198.45 C4#26.1 100.82,198.43 C3#25.1 102.67,198.37 v1(104.71,198.37) 106.57,196.51 118.77,196.51 U2#26.10 119.67,196.53 U2#26.8 ; U2.8 26.67,196.55 U2.10 25.77,196.52 13.57,196.52 v1(11.71,198.38) 9.67,198.38 C3.1 7.82,198.44 C4#3.1 6.83,198.46 v1(6.27,199.02) 6.27,199.72 9.28,202.73 9.28,205.03 9.53,205.29 10.71,205.29 U1.8 ; 1.92,113.06 C10#4.1 1.92,112.09 v1(1.92,110.5) ; 1.92,113.06 C9#4.2 1.92,118.76 v1(3.97,120.8) v1(3.97,130.72) ; 1.92,113.06 4.62,113.06 X1#4.2 5.82,113.76 X1#4.4 ; v1(1.92,203.5) 1.92,205.09 C10.1 1.92,206.06 ; U2#4.9 22.34,126.15 P1#4.9 ; v1(63.92,177.51) 63.92,179.1 C10#19.1 63.92,180.07 ; U2#14.8 26.67,227.55 U2#14.10 25.77,227.52 13.57,227.52 v1(11.71,229.38) 9.67,229.38 C3#31.1 7.82,229.44 C4#32.1 6.83,229.46 v1(6.27,230.02) 6.27,230.72 9.28,233.73 9.28,236.03 9.53,236.29 10.71,236.29 U1#32.8 ; U2#24.8 88.67,5.53 U2#24.10 87.77,5.5 75.57,5.5 v1(73.71,7.36) 71.67,7.36 C3#23.1 69.82,7.43 69.8,7.44 68.83,7.44 v1(68.27,8) 68.27,8.7 71.28,11.71 71.28,14.02 71.53,14.27 72.71,14.27 U1#23.8 ; v1(96.97,99.71) v1(96.97,89.79) 94.92,87.75 C9#30.2 94.92,82.05 ; X1#23.4 67.82,46.74 X1#23.2 66.62,46.04 63.92,46.04 ; U1#23.23 79.23,9.82 79.06,9.66 76.66,9.66 76.08,9.09 v1(76.08,7.42) 79.72,7.42 C5#23.1 C6#23.2 ; v1(67.82,249.81) 68.95,249.81 C2#17.2 69.01,249.81 C7#18.1 74.29,249.88 75.38,248.79 75.38,248.03 74.73,247.38 U1#16.47 ; U2#25.8 119.67,227.53 U2#25.10 118.77,227.51 106.57,227.51 v1(104.71,229.37) 102.67,229.37 C3#24.1 100.82,229.43 C4#25.1 99.83,229.45 v1(99.27,230.01) 99.27,230.71 102.28,233.72 102.28,236.02 102.53,236.28 103.71,236.28 U1#24.8 ; X1#27.4 98.82,175.75 X1#27.2 97.62,175.05 94.92,175.05 ; C6#15.2 C5#15.1 48.72,7.42 v1(45.08,7.42) 45.08,9.09 45.66,9.66 48.06,9.66 48.23,9.83 U1#15.23 ; v1(36.82,156.82) 37.95,156.82 C2#12.2 38.01,156.82 C7#12.1 43.29,156.88 44.38,155.8 44.38,155.04 43.73,154.39 U1#11.47 ; U1#17.8 72.71,210.3 71.53,210.3 71.28,210.05 71.28,207.74 68.27,204.73 v1(68.27,204.03) 68.83,203.47 C4#18.1 69.82,203.46 C3#17.1 71.67,203.39 v1(73.71,203.39) 75.57,201.53 87.77,201.53 U2#18.10 88.67,201.56 U2#18.8 ; P1#19.9 84.34,193.16 U2#19.9 ; U1#30.8 103.71,50.28 102.53,50.28 102.28,50.02 102.28,47.72 99.27,44.71 v1(99.27,44.01) 99.83,43.45 C4#30.1 100.82,43.43 C3#30.1 102.67,43.37 v1(104.71,43.37) 106.57,41.51 118.77,41.51 U2#31.10 119.67,41.53 U2#31.8 ; U1#25.23 110.23,200.83 110.06,200.67 107.66,200.67 107.08,200.09 v1(107.08,198.43) 110.72,198.43 C5#25.1 C6#25.2 ; P1.9 22.34,219.15 U2.9 ; 1.92,175.06 C9#2.2 1.92,180.76 v1(3.97,182.8) v1(3.97,192.72) ; 1.92,175.06 4.62,175.06 X1#2.2 5.82,175.76 X1#2.4 ; 1.92,175.06 C10#2.1 1.92,174.09 v1(1.92,172.5) ; 32.92,211.07 35.62,211.07 X1#9.2 36.82,211.77 X1#9.4 ; 32.92,211.07 C10#9.1 32.92,210.1 v1(32.92,208.51) ; 32.92,211.07 C9#9.2 32.92,216.77 v1(34.97,218.81) v1(34.97,228.73) ; U1#16.8 72.71,241.3 71.53,241.3 71.28,241.05 71.28,238.74 68.27,235.73 v1(68.27,235.03) 68.83,234.47 C4#17.1 69.82,234.46 C3#16.1 71.67,234.39 v1(73.71,234.39) 75.57,232.53 87.77,232.53 U2#17.10 88.67,232.56 U2#17.8 ; P1#7.9 22.34,33.15 U2#7.9 ; 32.92,77.04 C9#13.2 32.92,82.74 v1(34.97,84.78) v1(34.97,94.7) ; 32.92,77.04 C10#13.1 32.92,76.07 v1(32.92,74.48) ; 32.92,77.04 35.62,77.04 X1#13.2 36.82,77.74 X1#13.4 ; 94.92,113.05 C9#29.2 94.92,118.75 v1(96.97,120.79) v1(96.97,130.71) ; 94.92,113.05 97.62,113.05 X1#29.2 98.82,113.75 X1#29.4 ; 94.92,113.05 C10#29.1 94.92,112.08 v1(94.92,110.49) ; v1(3.97,37.72) v1(3.97,27.8) 1.92,25.76 C9#7.2 1.92,20.06 ; 94.92,51.05 C10#31.1 94.92,50.08 v1(94.92,48.49) ; 94.92,51.05 97.62,51.05 X1#31.2 98.82,51.75 X1#31.4 ; 94.92,51.05 C9#31.2 94.92,56.75 v1(96.97,58.79) v1(96.97,68.71) ; U1#8.8 41.71,241.3 40.53,241.3 40.28,241.05 40.28,238.74 37.27,235.73 v1(37.27,235.03) 37.83,234.47 C4#9.1 38.82,234.46 C3#8.1 40.67,234.39 v1(42.71,234.39) 44.57,232.53 56.77,232.53 U2#8.10 57.67,232.56 U2#8.8 ; U1.47 12.73,211.37 13.38,212.02 13.38,212.78 12.29,213.86 C7.1 7.01,213.8 C2#3.2 6.95,213.8 v1(5.82,213.8) ; 63.92,149.08 C9#20.2 63.92,154.78 v1(65.97,156.82) v1(65.97,166.74) ; 63.92,149.08 C10#20.1 63.92,148.11 v1(63.92,146.52) ; 63.92,149.08 66.62,149.08 X1#20.2 67.82,149.78 X1#20.4 ; v1(65.97,228.73) v1(65.97,218.81) 63.92,216.77 C9#18.2 63.92,211.07 ; U2#17.9 84.34,255.16 P1#17.9 ; X1#7.4 5.82,20.76 X1#7.2 4.62,20.06 1.92,20.06 ; U2#21.8 88.67,98.53 U2#21.10 87.77,98.5 75.57,98.5 v1(73.71,100.36) 71.67,100.36 C3#20.1 69.82,100.43 69.8,100.44 68.83,100.44 v1(68.27,101) 68.27,101.7 71.28,104.71 71.28,107.02 71.53,107.27 72.71,107.27 U1#20.8 ; 32.92,180.08 C9#10.2 32.92,185.78 v1(34.97,187.82) v1(34.97,197.74) ; 32.92,180.08 35.62,180.08 X1#10.2 36.82,180.78 X1#10.4 ; 32.92,180.08 C10#10.1 32.92,179.11 v1(32.92,177.52) ; U1#29.47 105.73,87.36 106.38,88.01 106.38,88.77 105.29,89.85 C7#30.1 100.01,89.79 99.98,89.82 99.95,89.79 v1(98.82,89.79) ; 1.92,82.06 4.62,82.06 X1#5.2 5.82,82.76 X1#5.4 ; 1.92,82.06 C10#5.1 1.92,81.09 v1(1.92,79.5) ; 1.92,82.06 C9#5.2 1.92,87.76 v1(3.97,89.8) v1(3.97,99.72) ; U1#26.23 110.23,169.83 110.06,169.67 107.66,169.67 107.08,169.09 v1(107.08,167.43) 110.72,167.43 C5#26.1 C6#26.2 ; U2#20.9 84.34,162.17 P1#20.9 ; v1(34.97,259.73) v1(34.97,249.81) 32.92,247.77 C9#8.2 32.92,242.07 ; v1(98.82,244.79) 99.95,244.79 C2#25.2 100.01,244.79 C7#25.1 105.29,244.85 106.38,243.77 106.38,243.01 105.73,242.36 U1#24.47 ; P1#10.9 53.34,193.17 U2#10.9 ; U1#7.8 10.71,19.29 9.53,19.29 9.28,19.03 9.28,16.73 6.27,13.72 v1(6.27,13.02) 6.83,12.46 C4.1 7.82,12.44 C3#7.1 9.67,12.38 v1(11.71,12.38) 13.57,10.52 25.77,10.52 U2#7.10 26.67,10.54 U2#7.8 ; 63.92,108.04 C10#21.1 63.92,107.07 v1(63.92,105.48) ; 63.92,108.04 C9#21.2 63.92,113.74 v1(65.97,115.78) v1(65.97,125.7) ; 63.92,108.04 66.62,108.04 X1#21.2 67.82,108.74 X1#21.4 ; U1#12.23 48.23,102.83 48.06,102.66 45.66,102.66 45.08,102.09 v1(45.08,100.42) 48.72,100.42 C5#12.1 C6#12.2 ; U1#27.23 110.23,138.83 110.06,138.67 107.66,138.67 107.08,138.09 v1(107.08,136.43) 110.72,136.43 C5#27.1 C6#27.2 ; U1#6.8 10.71,50.29 9.53,50.29 9.28,50.03 9.28,47.73 6.27,44.72 v1(6.27,44.02) 6.83,43.46 C4#8.1 7.82,43.44 C3#6.1 9.67,43.38 v1(11.71,43.38) 13.57,41.52 25.77,41.52 U2#6.10 26.67,41.54 U2#6.8 ; 1.92,237.06 4.62,237.06 X1#14.2 5.82,237.76 X1#14.4 ; 1.92,237.06 C10#16.1 1.92,236.09 v1(1.92,234.5) ; 1.92,237.06 C9#15.2 1.92,242.76 v1(3.97,244.8) v1(3.97,254.72) ; U1#29.8 103.71,81.28 102.53,81.28 102.28,81.02 102.28,78.72 99.27,75.71 v1(99.27,75.01) 99.83,74.45 C4#2.1 100.82,74.43 C3#29.1 102.67,74.37 v1(104.71,74.37) 106.57,72.51 118.77,72.51 U2#30.10 119.67,72.53 U2#30.8 ; C6#17.2 C5#17.1 79.72,203.45 v1(76.08,203.45) 76.08,205.12 76.66,205.69 79.06,205.69 79.23,205.86 U1#17.23 ; U2#15.8 57.67,36.53 U2#15.10 56.77,36.5 44.57,36.5 v1(42.71,38.36) 40.67,38.36 C3#14.1 38.82,38.43 38.8,38.44 37.83,38.44 v1(37.27,39) 37.27,39.7 40.28,42.71 40.28,45.02 40.53,45.27 41.71,45.27 U1#14.8 ; U1#4.8 10.71,112.29 9.53,112.29 9.28,112.03 9.28,109.73 6.27,106.72 v1(6.27,106.02) 6.83,105.46 C4#6.1 7.82,105.44 C3#4.1 9.67,105.38 v1(11.71,105.38) 13.57,103.52 25.77,103.52 U2#4.10 26.67,103.54 U2#4.8 ; U1#6.47 12.73,56.37 13.38,57.02 13.38,57.78 12.29,58.86 C7#6.1 7.01,58.8 C2#8.2 6.95,58.8 v1(5.82,58.8) ; U1#10.23 48.23,174.86 48.06,174.7 45.66,174.7 45.08,174.12 v1(45.08,172.46) 48.72,172.46 C5#10.1 C6#10.2 ; P1#27.9 115.34,188.14 U2#27.9 ; U2#23.9 84.34,59.13 P1#23.9 ; 56.8,117.68 53.34,121.13 P1#12.9 ; C6#4.2 C5#4.1 17.72,105.44 v1(14.08,105.44) 14.08,107.1 14.66,107.68 17.06,107.68 17.23,107.84 U1#4.23 ; U2#2.9 22.34,188.15 P1#2.9 ; U1#5.47 12.73,87.37 13.38,88.02 13.38,88.78 12.29,89.86 C7#5.1 7.01,89.8 C2#7.2 6.95,89.8 v1(5.82,89.8) ; U1#5.8 10.71,81.29 9.53,81.29 9.28,81.03 9.28,78.73 6.27,75.72 v1(6.27,75.02) 6.83,74.46 C4#7.1 7.82,74.44 C3#5.1 9.67,74.38 v1(11.71,74.38) 13.57,72.52 25.77,72.52 U2#5.10 26.67,72.54 U2#5.8 ; v1(67.82,53.78) 68.95,53.78 C2#23.2 69.01,53.78 C7#23.1 74.29,53.85 75.38,52.76 75.38,52 74.73,51.35 U1#22.47 ; U2#20.8 88.67,139.56 U2#20.10 87.77,139.54 75.57,139.54 v1(73.71,141.4) 71.67,141.4 C3#19.1 69.82,141.46 C4#20.1 68.83,141.48 v1(68.27,142.04) 68.27,142.74 71.28,145.75 71.28,148.05 71.53,148.31 72.71,148.31 U1#19.8 ; v1(65.97,32.7) v1(65.97,22.78) 63.92,20.74 C9#24.2 63.92,15.04 ; U1.23 17.23,200.84 17.06,200.68 14.66,200.68 14.08,200.1 v1(14.08,198.44) 17.72,198.44 C5.1 C6.2 ; U1#27.8 103.71,143.28 102.53,143.28 102.28,143.02 102.28,140.72 99.27,137.71 v1(99.27,137.01) 99.83,136.45 C4#28.1 100.82,136.43 C3#27.1 102.67,136.37 v1(104.71,136.37) 106.57,134.51 118.77,134.51 U2#28.10 119.67,134.53 U2#28.8 ; U2#31.9 115.34,64.14 P1#31.9 ; U2#32.8 119.67,10.53 U2#32.10 118.77,10.51 106.57,10.51 v1(104.71,12.37) 102.67,12.37 C3#32.1 100.82,12.43 C4#31.1 99.83,12.45 v1(99.27,13.01) 99.27,13.71 102.28,16.72 102.28,19.02 102.53,19.28 103.71,19.28 U1#31.8 ; 63.92,46.04 C10#23.1 63.92,45.07 v1(63.92,43.48) ; 63.92,46.04 C9#23.2 63.92,51.74 v1(65.97,53.78) v1(65.97,63.7) ; U1#30.23 110.23,45.83 110.06,45.67 107.66,45.67 107.08,45.09 v1(107.08,43.43) 110.72,43.43 C5#30.1 C6#30.2 ; U2#13.9 53.34,90.13 P1#13.9 ; 94.92,175.05 C10#27.1 94.92,174.08 v1(94.92,172.49) ; 94.92,175.05 C9#27.2 94.92,180.75 v1(96.97,182.79) v1(96.97,192.71) ; U2#23.8 88.67,36.53 U2#23.10 87.77,36.5 75.57,36.5 v1(73.71,38.36) 71.67,38.36 C3#22.1 69.82,38.43 69.8,38.44 68.83,38.44 v1(68.27,39) 68.27,39.7 71.28,42.71 71.28,45.02 71.53,45.27 72.71,45.27 U1#22.8 ; P1#30.9 115.34,95.14 U2#30.9 ; v1(94.92,203.49) 94.92,205.08 C10#26.1 94.92,206.05 ; U2#9.9 53.34,224.16 P1#9.9 ; C6#3.2 C5#3.1 17.72,136.44 v1(14.08,136.44) 14.08,138.1 14.66,138.68 17.06,138.68 17.23,138.84 U1#3.23 ; 1.92,206.06 C9.2 1.92,211.76 v1(3.97,213.8) v1(3.97,223.72) ; 1.92,206.06 4.62,206.06 X1.2 5.82,206.76 X1.4 ; U1#15.47 43.73,20.35 44.38,21 44.38,21.76 43.29,22.85 C7#17.1 38.01,22.78 C2#16.2 37.95,22.78 v1(36.82,22.78) ; P1#22.9 84.34,90.13 U2#22.9 ; v1(98.82,120.79) 99.95,120.79 C2#30.2 100.01,120.79 C7#29.1 105.29,120.85 106.38,119.77 106.38,119.01 105.73,118.36 U1#28.47 ; 32.92,108.04 C9#12.2 32.92,113.74 v1(34.97,115.78) v1(34.97,125.7) ; 32.92,108.04 C10#12.1 32.92,107.07 v1(32.92,105.48) ; 32.92,108.04 35.62,108.04 X1#12.2 36.82,108.74 X1#12.4 ; v1(32.92,12.48) 32.92,14.08 C10#15.1 32.92,15.04 ; P1#21.9 84.34,121.13 87.8,117.68 ; P1#24.9 84.34,28.13 U2#24.9 ; C6#14.2 C5#14.1 48.72,38.42 v1(45.08,38.42) 45.08,40.09 45.66,40.66 48.06,40.66 48.23,40.82 U1#14.23 ; U1#10.8 41.71,179.31 40.53,179.31 40.28,179.05 40.28,176.75 37.27,173.74 v1(37.27,173.04) 37.83,172.48 C4#11.1 38.82,172.46 C3#10.1 40.67,172.4 v1(42.71,172.4) 44.57,170.54 56.77,170.54 U2#10.10 57.67,170.56 U2#10.8 ; U2#22.8 88.67,67.53 U2#22.10 87.77,67.5 75.57,67.5 v1(73.71,69.36) 71.67,69.36 C3#21.1 69.82,69.43 69.8,69.44 68.83,69.44 v1(68.27,70) 68.27,70.7 71.28,73.71 71.28,76.02 71.53,76.27 72.71,76.27 U1#21.8 ; U1#13.23 48.23,71.82 48.06,71.66 45.66,71.66 45.08,71.09 v1(45.08,69.42) 48.72,69.42 C5#13.1 C6#13.2 ; P1#29.9 115.34,126.14 U2#29.9 ; v1(67.82,115.78) 68.95,115.78 C2#21.2 69.01,115.78 C7#21.1 74.29,115.85 75.38,114.76 75.38,114 74.73,113.35 U1#20.47 ; v1(96.97,223.71) v1(96.97,213.79) 94.92,211.75 C9#26.2 94.92,206.05 ; U2#16.9 53.34,28.13 P1#16.9 ; U1#6.23 17.23,45.84 17.06,45.68 14.66,45.68 14.08,45.1 v1(14.08,43.44) 17.72,43.44 C5#6.1 C6#6.2 ; 32.92,242.07 35.62,242.07 X1#8.2 36.82,242.77 X1#8.4 ; 32.92,242.07 C10#8.1 32.92,241.1 v1(32.92,239.51) ; P1#14.9 22.34,250.15 U2#14.9 ; X1#30.4 98.82,82.75 X1#30.2 97.62,82.05 94.92,82.05 ; v1(96.97,37.71) v1(96.97,27.79) 94.92,25.75 C9#32.2 94.92,20.05 ; v1(94.92,141.49) 94.92,143.08 C10#28.1 94.92,144.05 ; X1#24.4 67.82,15.74 X1#24.2 66.62,15.04 63.92,15.04 ; U2#25.9 115.34,250.14 P1#25.9 ; U1#14.47 43.73,51.35 44.38,52 44.38,52.76 43.29,53.85 C7#16.1 38.01,53.78 C2#15.2 37.95,53.78 v1(36.82,53.78) ; U2#3.9 22.34,157.15 P1#3.9 ; v1(94.92,79.49) 94.92,81.08 C10#30.1 94.92,82.05 ; v1(65.97,259.73) v1(65.97,249.81) 63.92,247.77 C9#17.2 63.92,242.07 ; U1#9.23 48.23,205.86 48.06,205.69 45.66,205.69 45.08,205.12 v1(45.08,203.45) 48.72,203.45 C5#9.1 C6#9.2 ; v1(98.82,182.79) 99.95,182.79 C2#28.2 100.01,182.79 C7#27.1 105.29,182.85 106.38,181.77 106.38,181.01 105.73,180.36 U1#26.47 ; 32.92,15.04 35.62,15.04 X1#16.2 36.82,15.74 X1#16.4 ; 32.92,15.04 C9#16.2 32.92,20.74 v1(34.97,22.78) v1(34.97,32.7) ; 1.92,51.06 C10#6.1 1.92,50.09 v1(1.92,48.5) ; 1.92,51.06 C9#6.2 1.92,56.76 v1(3.97,58.8) v1(3.97,68.72) ; 1.92,51.06 4.62,51.06 X1#6.2 5.82,51.76 X1#6.4 ; 32.92,149.08 C9#11.2 32.92,154.78 v1(34.97,156.82) v1(34.97,166.74) ; 32.92,149.08 C10#11.1 32.92,148.11 v1(32.92,146.52) ; 32.92,149.08 35.62,149.08 X1#11.2 36.82,149.78 X1#11.4 ; 94.92,144.05 97.62,144.05 X1#28.2 98.82,144.75 X1#28.4 ; 94.92,144.05 C9#28.2 94.92,149.75 v1(96.97,151.79) v1(96.97,161.71) ; 32.92,46.04 35.62,46.04 X1#15.2 36.82,46.74 X1#15.4 ; 32.92,46.04 C10#14.1 32.92,45.07 v1(32.92,43.48) ; 32.92,46.04 C9#14.2 32.92,51.74 v1(34.97,53.78) v1(34.97,63.7) ; P1#28.9 115.34,157.14 U2#28.9 ; v1(65.97,197.73) v1(65.97,187.81) 63.92,185.77 C9#19.2 63.92,180.07 ; U2#19.8 88.67,170.56 U2#19.10 87.77,170.53 75.57,170.53 v1(73.71,172.39) 71.67,172.39 C3#18.1 69.82,172.46 C4#19.1 68.83,172.47 v1(68.27,173.03) 68.27,173.73 71.28,176.74 71.28,179.05 71.53,179.3 72.71,179.3 U1#18.8 ; U2#11.8 57.67,139.56 U2#11.10 56.77,139.54 44.57,139.54 v1(42.71,141.4) 40.67,141.4 C3#11.1 38.82,141.46 C4#12.1 37.83,141.48 v1(37.27,142.04) 37.27,142.74 40.28,145.75 40.28,148.05 40.53,148.31 41.71,148.31 U1#11.8 ; P1#11.9 53.34,162.17 U2#11.9 ; C6#29.2 C5#29.1 110.72,74.43 v1(107.08,74.43) 107.08,76.09 107.66,76.67 110.06,76.67 110.23,76.83 U1#29.23 ; P1#6.9 22.34,64.15 U2#6.9 ; C6#16.2 C5#16.1 79.72,234.45 v1(76.08,234.45) 76.08,236.12 76.66,236.69 79.06,236.69 79.23,236.86 U1#16.23 ; C6#18.2 C5#18.1 79.72,172.45 v1(76.08,172.45) 76.08,174.12 76.66,174.69 79.06,174.69 79.23,174.86 U1#18.23 ; U1#20.23 79.23,102.82 79.06,102.66 76.66,102.66 76.08,102.09 v1(76.08,100.42) 79.72,100.42 C5#20.1 C6#20.2 ; X1#26.4 98.82,206.75 X1#26.2 97.62,206.05 94.92,206.05 ; U1#22.23 79.23,40.82 79.06,40.66 76.66,40.66 76.08,40.09 v1(76.08,38.42) 79.72,38.42 C5#22.1 C6#22.2 ; v1(67.82,156.82) 68.95,156.82 C2#20.2 69.01,156.82 C7#20.1 74.29,156.88 75.38,155.8 75.38,155.04 74.73,154.39 U1#19.47 ; 1.92,20.06 C10#7.1 1.92,19.09 v1(1.92,17.5) ; U1#5.23 17.23,76.84 17.06,76.68 14.66,76.68 14.08,76.1 v1(14.08,74.44) 17.72,74.44 C5#5.1 C6#5.2 ; 1.92,144.06 C9#3.2 1.92,149.76 v1(3.97,151.8) v1(3.97,161.72) ; 1.92,144.06 C10#3.1 1.92,143.09 v1(1.92,141.5) ; 1.92,144.06 4.62,144.06 X1#3.2 5.82,144.76 X1#3.4 ; 63.92,211.07 C10#18.1 63.92,210.1 v1(63.92,208.51) ; 63.92,211.07 66.62,211.07 X1#18.2 67.82,211.77 X1#18.4 ; U1#9.47 43.73,216.38 44.38,217.03 44.38,217.79 43.29,218.88 C7#9.1 38.01,218.81 C2#10.2 37.95,218.81 v1(36.82,218.81) ; 94.92,237.05 97.62,237.05 X1#25.2 98.82,237.75 X1#25.4 ; 94.92,237.05 C9#25.2 94.92,242.75 v1(96.97,244.79) v1(96.97,254.71) ; 94.92,237.05 C10#25.1 94.92,236.08 v1(94.92,234.49) ; v1(5.82,244.8) 6.95,244.8 C2#26.2 7.01,244.8 C7#13.1 12.29,244.86 13.38,243.78 13.38,243.02 12.73,242.37 U1#32.47 ; U1#28.8 103.71,112.28 102.53,112.28 102.28,112.02 102.28,109.72 99.27,106.71 v1(99.27,106.01) 99.83,105.45 C4#29.1 100.82,105.43 C3#28.1 102.67,105.37 v1(104.71,105.37) 106.57,103.51 118.77,103.51 U2#29.10 119.67,103.53 U2#29.8 ; U1#21.23 79.23,71.82 79.06,71.66 76.66,71.66 76.08,71.09 v1(76.08,69.42) 79.72,69.42 C5#21.1 C6#21.2 ; U2#2.8 26.67,165.55 U2#2.10 25.77,165.52 13.57,165.52 v1(11.71,167.38) 9.67,167.38 C3#2.1 7.82,167.44 C4#4.1 6.83,167.46 v1(6.27,168.02) 6.27,168.72 9.28,171.73 9.28,174.03 9.53,174.29 10.71,174.29 U1#2.8 ; U2#26.9 115.34,219.14 P1#26.9 ; U1#4.47 12.73,118.37 13.38,119.02 13.38,119.78 12.29,120.86 C7#4.1 7.01,120.8 6.97,120.83 6.95,120.8 v1(5.82,120.8) ; U1#23.47 74.73,20.35 75.38,21 75.38,21.76 74.29,22.85 C7#24.1 69.01,22.78 C2#24.2 68.95,22.78 v1(67.82,22.78) ; P1#5.9 22.34,95.15 U2#5.9 ; P1#8.9 53.34,255.16 U2#8.9 ; C6#31.2 C5#31.1 110.72,12.43 v1(107.08,12.43) 107.08,14.09 107.66,14.67 110.06,14.67 110.23,14.83 U1#31.23 ; C6#11.2 C5#11.1 48.72,141.46 v1(45.08,141.46) 45.08,143.12 45.66,143.7 48.06,143.7 48.23,143.86 U1#11.23 ; C6#8.2 C5#8.1 48.72,234.45 v1(45.08,234.45) 45.08,236.12 45.66,236.69 48.06,236.69 48.23,236.86 U1#8.23 ; U2#12.8 57.67,98.53 U2#12.10 56.77,98.5 44.57,98.5 v1(42.71,100.36) 40.67,100.36 C3#12.1 38.82,100.43 38.8,100.44 37.83,100.44 v1(37.27,101) 37.27,101.7 40.28,104.71 40.28,107.02 40.53,107.27 41.71,107.27 U1#12.8 ; 63.92,15.04 C10#24.1 63.92,14.07 v1(63.92,12.48) ; U1#32.23 17.23,231.84 17.06,231.68 14.66,231.68 14.08,231.1 v1(14.08,229.44) 17.72,229.44 C5#32.1 C6#32.2 ; 63.92,242.07 66.62,242.07 67.32,242.77 67.82,242.77 X1#17.4 ; 63.92,242.07 C10#17.1 63.92,241.1 v1(63.92,239.51) ; U2#27.8 119.67,165.53 U2#27.10 118.77,165.51 106.57,165.51 v1(104.71,167.37) 102.67,167.37 C3#26.1 100.82,167.43 C4#27.1 99.83,167.45 v1(99.27,168.01) 99.27,168.71 102.28,171.72 102.28,174.02 102.53,174.28 103.71,174.28 U1#26.8 ; v1(67.82,218.81) 68.95,218.81 C2#18.2 69.01,218.81 C7#19.1 74.29,218.88 75.38,217.79 75.38,217.03 74.73,216.38 U1#17.47 ; U1#7.47 12.73,25.37 13.38,26.02 13.38,26.78 12.29,27.86 C7#7.1 7.01,27.8 C2.2 6.95,27.8 v1(5.82,27.8) ; C6#19.2 C5#19.1 79.72,141.46 v1(76.08,141.46) 76.08,143.12 76.66,143.7 79.06,143.7 79.23,143.86 U1#19.23 ; v1(36.82,249.81) 37.95,249.81 C2#9.2 38.01,249.81 C7#8.1 43.29,249.88 44.38,248.79 44.38,248.03 43.73,247.38 U1#8.47 ; P1#32.9 115.34,33.14 U2#32.9 ; v1(36.82,187.82) 37.95,187.82 C2#11.2 38.01,187.82 C7#11.1 43.29,187.88 44.38,186.8 44.38,186.04 43.73,185.39 U1#10.47 ; U1#2.47 12.73,180.37 13.38,181.02 13.38,181.78 12.29,182.86 C7#2.1 7.01,182.8 C2#4.2 6.95,182.8 v1(5.82,182.8) ; C6#28.2 C5#28.1 110.72,105.43 v1(107.08,105.43) 107.08,107.09 107.66,107.67 110.06,107.67 110.23,107.83 U1#28.23 ; U1#24.23 110.23,231.83 110.06,231.67 107.66,231.67 107.08,231.09 v1(107.08,229.43) 110.72,229.43 C5#24.1 C6#24.2 ; 63.92,180.07 66.62,180.07 X1#19.2 67.82,180.77 X1#19.4 ; U2#15.9 53.34,59.13 P1#15.9 ; C6#7.2 C5#7.1 17.72,12.44 v1(14.08,12.44) 14.08,14.1 14.66,14.68 17.06,14.68 17.23,14.84 U1#7.23 ; v1(36.82,84.78) 37.95,84.78 C2#14.2 38.01,84.78 C7#15.1 43.29,84.85 44.38,83.76 44.38,83 43.73,82.35 U1#13.47 ; v1(94.92,17.49) 94.92,19.08 C10#32.1 94.92,20.05 ; v1(63.92,74.48) 63.92,76.07 C10#22.1 63.92,77.04 ; 94.92,20.05 97.62,20.05 X1#32.2 98.82,20.75 X1#32.4 ; 63.92,77.04 66.62,77.04 X1#22.2 67.82,77.74 X1#22.4 ; 63.92,77.04 C9#22.2 63.92,82.74 v1(65.97,84.78) v1(65.97,94.7) ; U1#2.23 17.23,169.84 17.06,169.68 14.66,169.68 14.08,169.1 v1(14.08,167.44) 17.72,167.44 C5#2.1 C6#2.2 ; v1(67.82,84.78) 68.95,84.78 C2#22.2 69.01,84.78 C7#22.1 74.29,84.85 75.38,83.76 75.38,83 74.73,82.35 U1#21.47 ; v1(98.82,213.79) 99.95,213.79 C2#27.2 100.01,213.79 C7#26.1 105.29,213.85 106.38,212.77 106.38,212.01 105.73,211.36 U1#25.47 ; v1(67.82,187.81) 68.95,187.81 C2#19.2 69.01,187.81 C7#10.1 74.29,187.88 75.38,186.79 75.38,186.03 74.73,185.38 U1#18.47 ; U1#3.47 12.73,149.37 13.38,150.02 13.38,150.78 12.29,151.86 C7#3.1 7.01,151.8 6.97,151.83 6.95,151.8 v1(5.82,151.8) ; U1#3.8 10.71,143.29 9.53,143.29 9.28,143.03 9.28,140.73 6.27,137.72 v1(6.27,137.02) 6.83,136.46 C4#5.1 7.82,136.44 C3#3.1 9.67,136.38 v1(11.71,136.38) 13.57,134.52 25.77,134.52 U2#3.10 26.67,134.55 U2#3.8 ; v1(98.82,58.79) 99.95,58.79 99.98,58.82 100.01,58.79 C7#31.1 105.29,58.85 106.38,57.77 106.38,57.01 105.73,56.36 U1#30.47 ; v1(98.82,27.79) 99.95,27.79 99.98,27.82 100.01,27.79 C7#32.1 105.29,27.85 106.38,26.77 106.38,26.01 105.73,25.36 U1#31.47 ; U1#27.47 105.73,149.36 106.38,150.01 106.38,150.77 105.29,151.85 C7#28.1 100.01,151.79 C2#29.2 99.95,151.79 v1(98.82,151.79) ; U2#18.9 84.34,224.16 P1#18.9 ; U1#15.8 41.71,14.27 40.53,14.27 40.28,14.02 40.28,11.71 37.27,8.7 v1(37.27,8) 37.83,7.44 C4#16.1 38.82,7.43 C3#15.1 40.67,7.36 v1(42.71,7.36) 44.57,5.5 56.77,5.5 U2#16.10 57.67,5.53 U2#16.8 ; U2#9.8 57.67,201.56 U2#9.10 56.77,201.53 44.57,201.53 v1(42.71,203.39) 40.67,203.39 C3#9.1 38.82,203.46 C4#10.1 37.83,203.47 v1(37.27,204.03) 37.27,204.73 40.28,207.74 40.28,210.05 40.53,210.3 41.71,210.3 U1#9.8
  Bottom Layer w0.254: v1(107.08,74.43) 107.02,74.37 v1(104.71,74.37) ; v1(67.82,187.81) v1(65.97,187.81) ; v1(11.71,136.38) 14.02,136.38 v1(14.08,136.44) ; v1(5.82,244.8) v1(3.97,244.8) ; v1(36.82,249.81) v1(34.97,249.81) ; P1#19.9 79.62,194.06 78.32,195.36 78.32,196.96 77.55,197.73 v1(65.97,197.73) ; v1(34.97,228.73) 46.55,228.73 47.32,227.96 47.32,226.36 48.62,225.06 P1#9.9 ; v1(107.08,198.43) 107.02,198.37 v1(104.71,198.37) ; v1(67.82,249.81) v1(65.97,249.81) ; P1#21.9 79.62,122.03 78.32,123.33 78.32,124.93 77.55,125.7 v1(65.97,125.7) ; v1(11.71,198.38) 14.02,198.38 v1(14.08,198.44) ; v1(32.92,12.48) 32.92,12.35 v1(37.27,8) ; P1#10.9 48.62,194.07 47.32,195.37 47.32,196.97 46.55,197.74 v1(34.97,197.74) ; v1(6.27,13.02) 1.92,17.37 v1(1.92,17.5) ; v1(6.27,106.02) 1.92,110.37 v1(1.92,110.5) ; P1#4.9 17.62,127.05 16.32,128.35 16.32,129.95 15.55,130.72 v1(3.97,130.72) ; P1.9 17.62,220.05 16.32,221.35 16.32,222.95 15.55,223.72 v1(3.97,223.72) ; v1(76.08,38.42) 76.02,38.36 v1(73.71,38.36) ; v1(96.97,130.71) 108.55,130.71 109.32,129.94 109.32,128.34 110.62,127.04 P1#29.9 ; v1(14.08,105.44) 14.02,105.38 v1(11.71,105.38) ; v1(96.97,99.71) 108.55,99.71 109.32,98.94 109.32,97.34 110.62,96.04 P1#30.9 ; v1(42.71,172.4) 45.02,172.4 v1(45.08,172.46) ; v1(65.97,63.7) 77.55,63.7 78.32,62.93 78.32,61.33 79.62,60.03 P1#23.9 ; v1(96.97,68.71) 108.55,68.71 109.32,67.94 109.32,66.34 110.62,65.04 P1#31.9 ; v1(34.97,125.7) 46.55,125.7 47.32,124.93 47.32,123.33 48.62,122.03 P1#12.9 ; v1(11.71,74.38) 14.02,74.38 v1(14.08,74.44) ; v1(5.82,213.8) v1(3.97,213.8) ; v1(107.08,105.43) 107.02,105.37 v1(104.71,105.37) ; v1(98.82,213.79) v1(96.97,213.79) ; v1(76.08,203.45) 76.02,203.39 v1(73.71,203.39) ; v1(99.27,44.01) 94.92,48.36 v1(94.92,48.49) ; v1(99.27,199.01) 94.92,203.36 v1(94.92,203.49) ; v1(76.08,7.42) 76.02,7.36 v1(73.71,7.36) ; v1(63.92,177.51) 63.92,177.38 v1(68.27,173.03) ; v1(63.92,74.48) 63.92,74.35 v1(68.27,70) ; v1(67.82,218.81) v1(65.97,218.81) ; P1#17.9 79.62,256.06 78.32,257.36 78.32,258.96 77.55,259.73 v1(65.97,259.73) ; v1(3.97,192.72) 15.55,192.72 16.32,191.95 16.32,190.35 17.62,189.05 P1#2.9 ; v1(99.27,230.01) 94.92,234.36 v1(94.92,234.49) ; v1(34.97,32.7) 46.55,32.7 47.32,31.94 47.32,30.34 48.62,29.03 P1#16.9 ; v1(68.27,39) 63.92,43.35 v1(63.92,43.48) ; v1(104.71,43.37) 107.02,43.37 v1(107.08,43.43) ; v1(65.97,94.7) 77.55,94.7 78.32,93.93 78.32,92.33 79.62,91.03 P1#22.9 ; v1(63.92,105.48) 63.92,105.35 v1(68.27,101) ; v1(5.82,120.8) v1(3.97,120.8) ; v1(32.92,74.48) 32.92,74.35 v1(37.27,70) ; v1(11.71,167.38) 14.02,167.38 v1(14.08,167.44) ; v1(3.97,254.72) 15.55,254.72 16.32,253.95 16.32,252.35 17.62,251.05 P1#14.9 ; v1(34.97,166.74) 46.55,166.74 47.32,165.97 47.32,164.37 48.62,163.07 P1#11.9 ; v1(98.82,58.79) v1(96.97,58.79) ; v1(45.08,100.42) 45.02,100.36 v1(42.71,100.36) ; P1#20.9 79.62,163.07 78.32,164.37 78.32,165.97 77.55,166.74 v1(65.97,166.74) ; v1(6.27,168.02) 1.92,172.37 v1(1.92,172.5) ; P1#7.9 17.62,34.05 16.32,35.35 16.32,36.95 15.55,37.72 v1(3.97,37.72) ; v1(96.97,192.71) 108.55,192.71 109.32,191.94 109.32,190.34 110.62,189.04 P1#27.9 ; v1(36.82,84.78) v1(34.97,84.78) ; v1(68.27,8) 63.92,12.35 v1(63.92,12.48) ; v1(42.71,38.36) 45.02,38.36 v1(45.08,38.42) ; v1(99.27,168.01) 94.92,172.36 v1(94.92,172.49) ; v1(67.82,53.78) v1(65.97,53.78) ; v1(32.92,43.48) 32.92,43.35 v1(37.27,39) ; v1(67.82,22.78) v1(65.97,22.78) ; v1(107.08,136.43) 107.02,136.37 v1(104.71,136.37) ; v1(99.27,137.01) 94.92,141.36 v1(94.92,141.49) ; v1(104.71,229.37) 107.02,229.37 v1(107.08,229.43) ; v1(36.82,53.78) v1(34.97,53.78) ; v1(94.92,79.49) 94.92,79.36 v1(99.27,75.01) ; v1(63.92,146.52) 63.92,146.39 v1(68.27,142.04) ; v1(45.08,203.45) 45.02,203.39 v1(42.71,203.39) ; v1(3.97,161.72) 15.55,161.72 16.32,160.95 16.32,159.35 17.62,158.05 P1#3.9 ; v1(76.08,172.45) 76.02,172.39 v1(73.71,172.39) ; v1(63.92,239.51) 63.92,239.38 v1(68.27,235.03) ; v1(34.97,94.7) 46.55,94.7 47.32,93.93 47.32,92.33 48.62,91.03 P1#13.9 ; v1(107.08,12.43) 107.02,12.37 v1(104.71,12.37) ; v1(5.82,27.8) v1(3.97,27.8) ; P1#6.9 17.62,65.05 16.32,66.35 16.32,67.95 15.55,68.72 v1(3.97,68.72) ; v1(65.97,228.73) 77.55,228.73 78.32,227.96 78.32,226.36 79.62,225.06 P1#18.9 ; v1(36.82,22.78) v1(34.97,22.78) ; v1(32.92,177.52) 32.92,177.39 v1(37.27,173.04) ; v1(73.71,100.36) 76.02,100.36 v1(76.08,100.42) ; v1(36.82,187.82) v1(34.97,187.82) ; P1#32.9 110.62,34.04 109.32,35.34 109.32,36.94 108.55,37.71 v1(96.97,37.71) ; v1(32.92,105.48) 32.92,105.35 v1(37.27,101) ; v1(99.27,13.01) 94.92,17.36 v1(94.92,17.49) ; v1(98.82,120.79) v1(96.97,120.79) ; v1(45.08,234.45) 45.02,234.39 v1(42.71,234.39) ; v1(1.92,48.5) 1.92,48.37 v1(6.27,44.02) ; v1(6.27,137.02) 1.92,141.37 v1(1.92,141.5) ; v1(34.97,259.73) 46.55,259.73 47.32,258.96 47.32,257.36 48.62,256.06 P1#8.9 ; v1(1.92,203.5) 1.92,203.37 v1(6.27,199.02) ; v1(107.08,167.43) 107.02,167.37 v1(104.71,167.37) ; v1(68.27,204.03) 63.92,208.38 v1(63.92,208.51) ; v1(98.82,151.79) v1(96.97,151.79) ; v1(5.82,151.8) v1(3.97,151.8) ; v1(1.92,79.5) 1.92,79.37 v1(6.27,75.02) ; v1(5.82,58.8) v1(3.97,58.8) ; v1(11.71,12.38) 14.02,12.38 v1(14.08,12.44) ; v1(42.71,7.36) 45.02,7.36 v1(45.08,7.42) ; v1(76.08,141.46) 76.02,141.4 v1(73.71,141.4) ; v1(98.82,27.79) v1(96.97,27.79) ; v1(32.92,146.52) 32.92,146.39 v1(37.27,142.04) ; v1(34.97,63.7) 46.55,63.7 47.32,62.93 47.32,61.33 48.62,60.03 P1#15.9 ; v1(42.71,141.4) 45.02,141.4 v1(45.08,141.46) ; v1(5.82,182.8) v1(3.97,182.8) ; v1(65.97,32.7) 77.55,32.7 78.32,31.93 78.32,30.33 79.62,29.03 P1#24.9 ; v1(32.92,208.51) 32.92,208.38 v1(37.27,204.03) ; v1(73.71,69.36) 76.02,69.36 v1(76.08,69.42) ; v1(94.92,110.49) 94.92,110.36 v1(99.27,106.01) ; P1#26.9 110.62,220.04 109.32,221.34 109.32,222.94 108.55,223.71 v1(96.97,223.71) ; v1(98.82,182.79) v1(96.97,182.79) ; P1#25.9 110.62,251.04 109.32,252.34 109.32,253.94 108.55,254.71 v1(96.97,254.71) ; v1(42.71,69.36) 45.02,69.36 v1(45.08,69.42) ; v1(37.27,235.03) 32.92,239.38 v1(32.92,239.51) ; v1(76.08,234.45) 76.02,234.39 v1(73.71,234.39) ; v1(98.82,244.79) v1(96.97,244.79) ; v1(11.71,229.38) 14.02,229.38 v1(14.08,229.44) ; v1(14.08,43.44) 14.02,43.38 v1(11.71,43.38) ; v1(1.92,234.5) 1.92,234.37 v1(6.27,230.02) ; v1(3.97,99.72) 15.55,99.72 16.32,98.95 16.32,97.35 17.62,96.05 P1#5.9 ; v1(36.82,156.82) v1(34.97,156.82) ; P1#28.9 110.62,158.04 109.32,159.34 109.32,160.94 108.55,161.71 v1(96.97,161.71) ; v1(36.82,115.78) v1(34.97,115.78) ; v1(67.82,115.78) v1(65.97,115.78) ; v1(36.82,218.81) v1(34.97,218.81) ; v1(5.82,89.8) v1(3.97,89.8) ; v1(98.82,89.79) v1(96.97,89.79) ; v1(67.82,156.82) v1(65.97,156.82) ; v1(67.82,84.78) v1(65.97,84.78)
